# EAGLE board PC104 (EAGLE 7.4.0), part 1 of 2
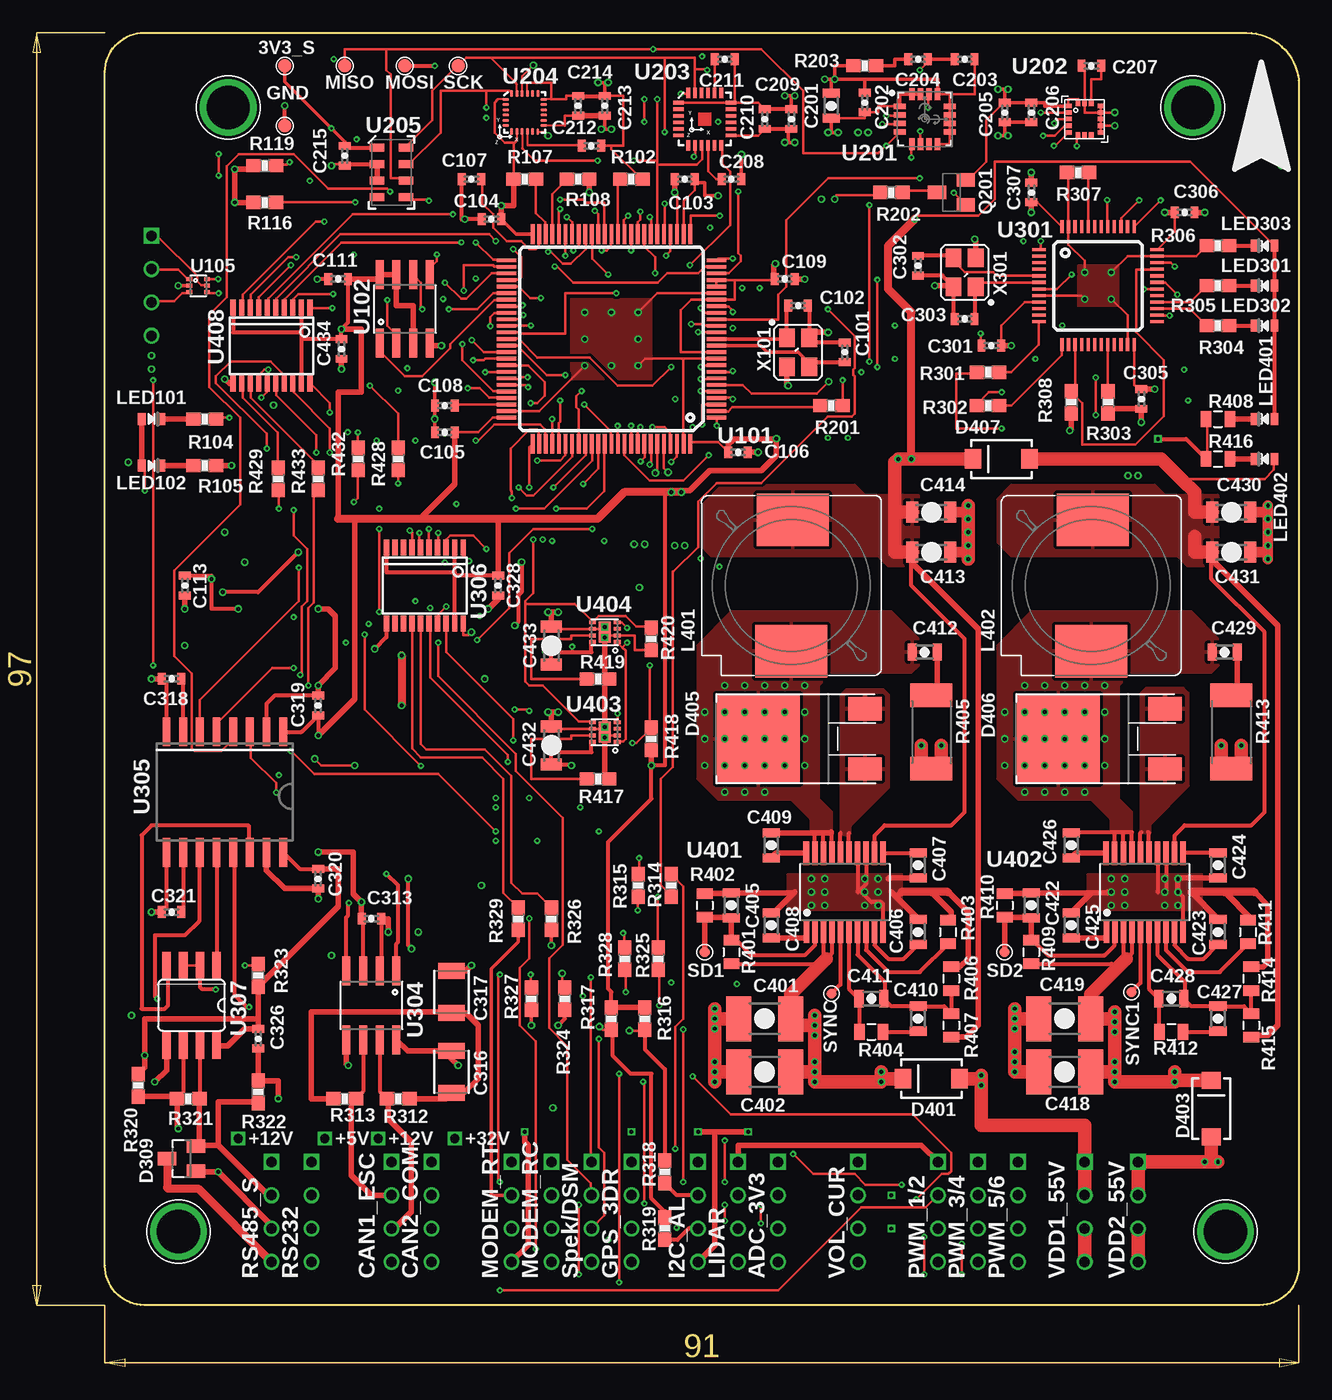
[diagram p5: board, top side]
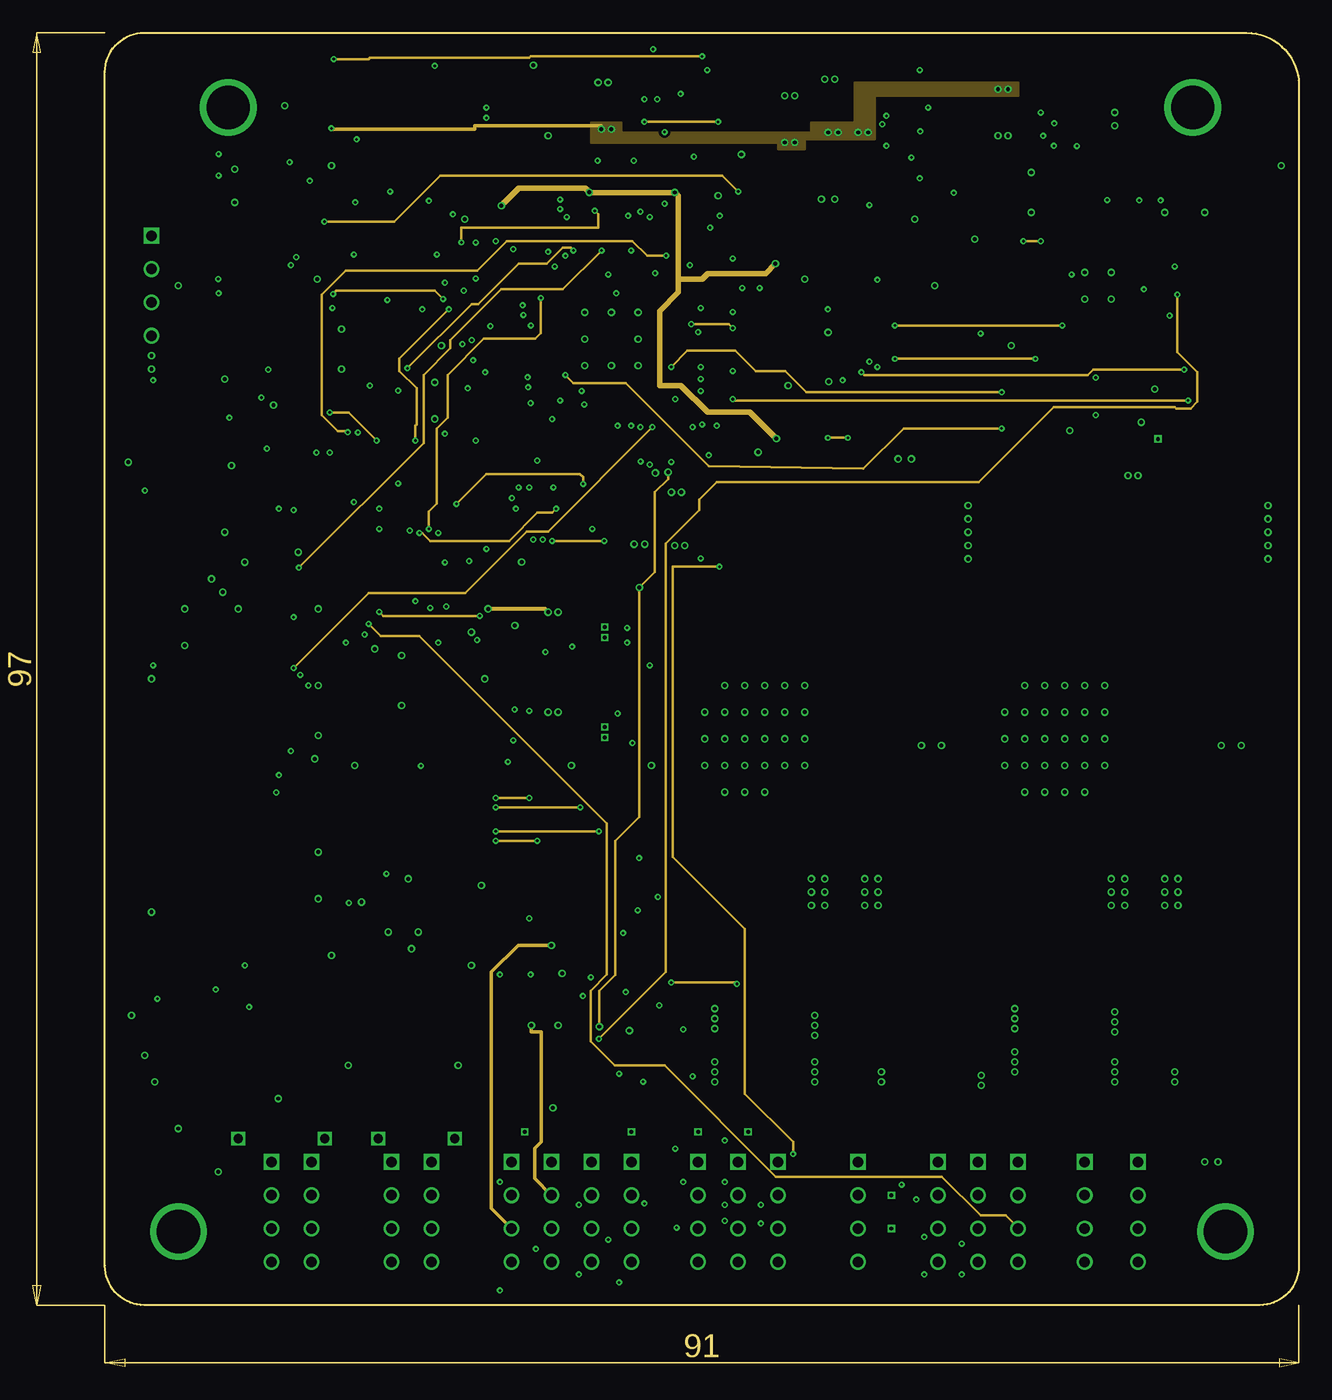
[diagram p6: board, inner layer Route2]
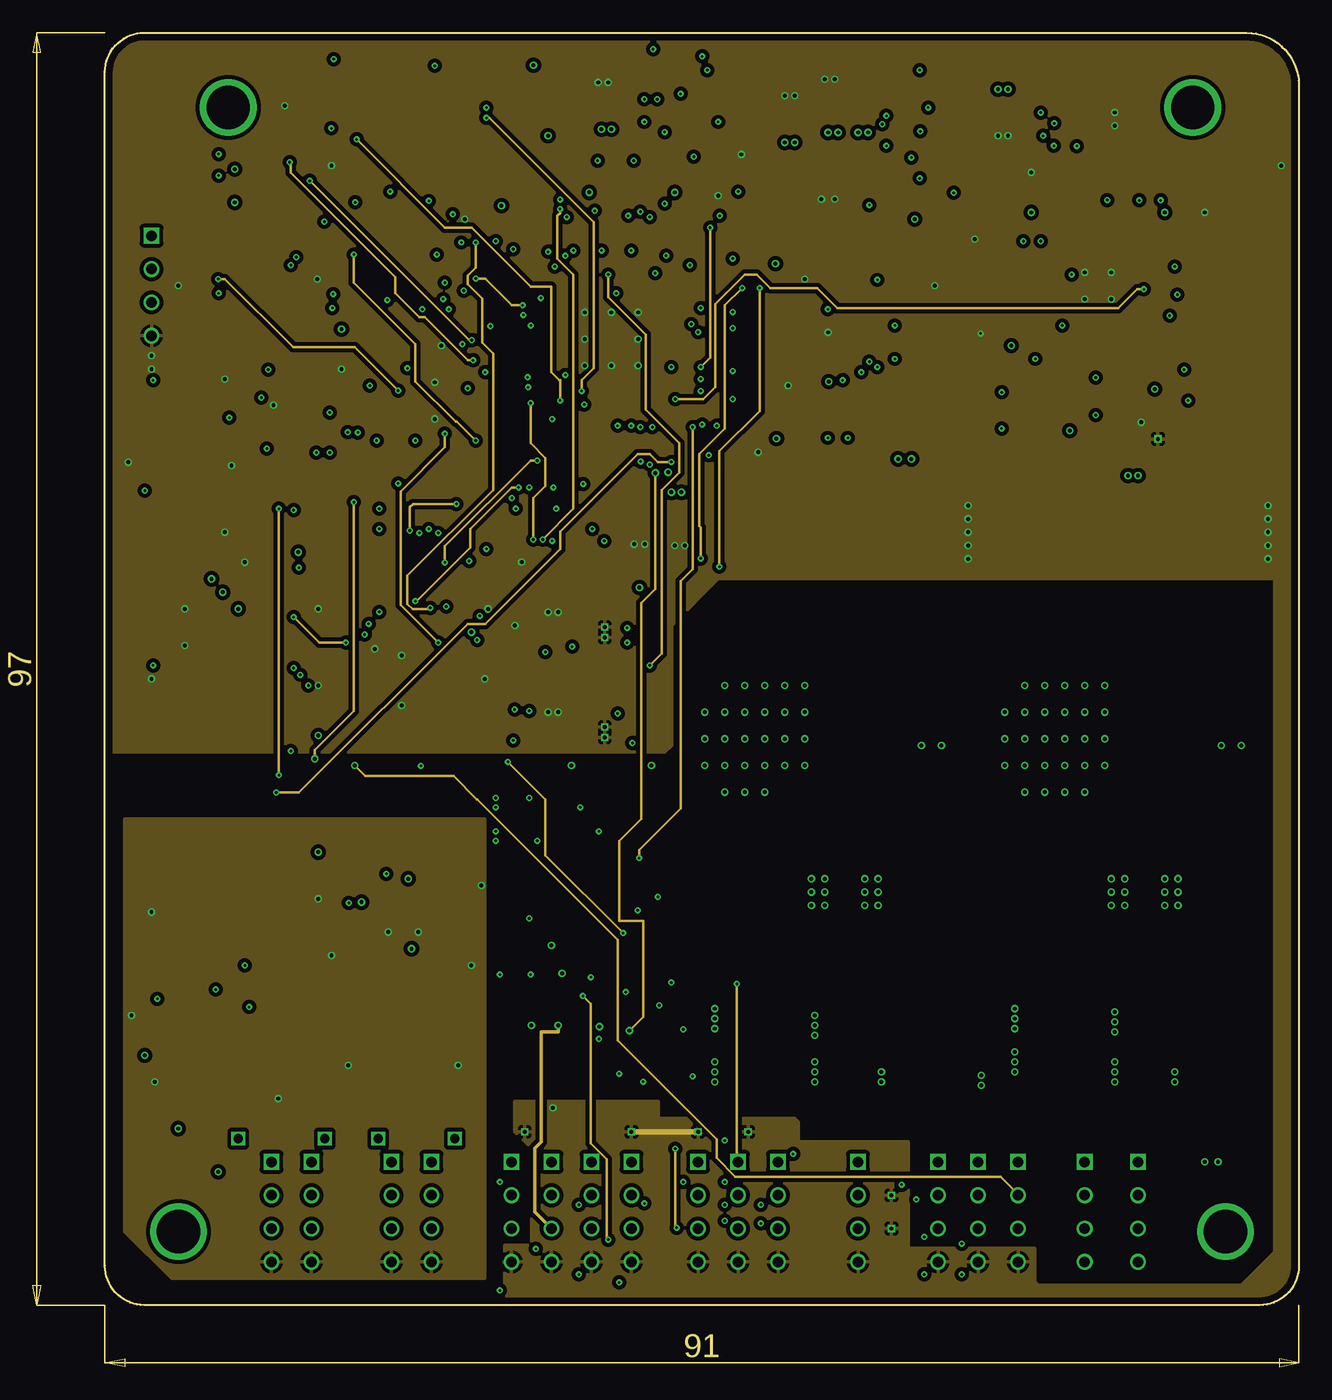
[diagram p7: board, inner layer Route15]
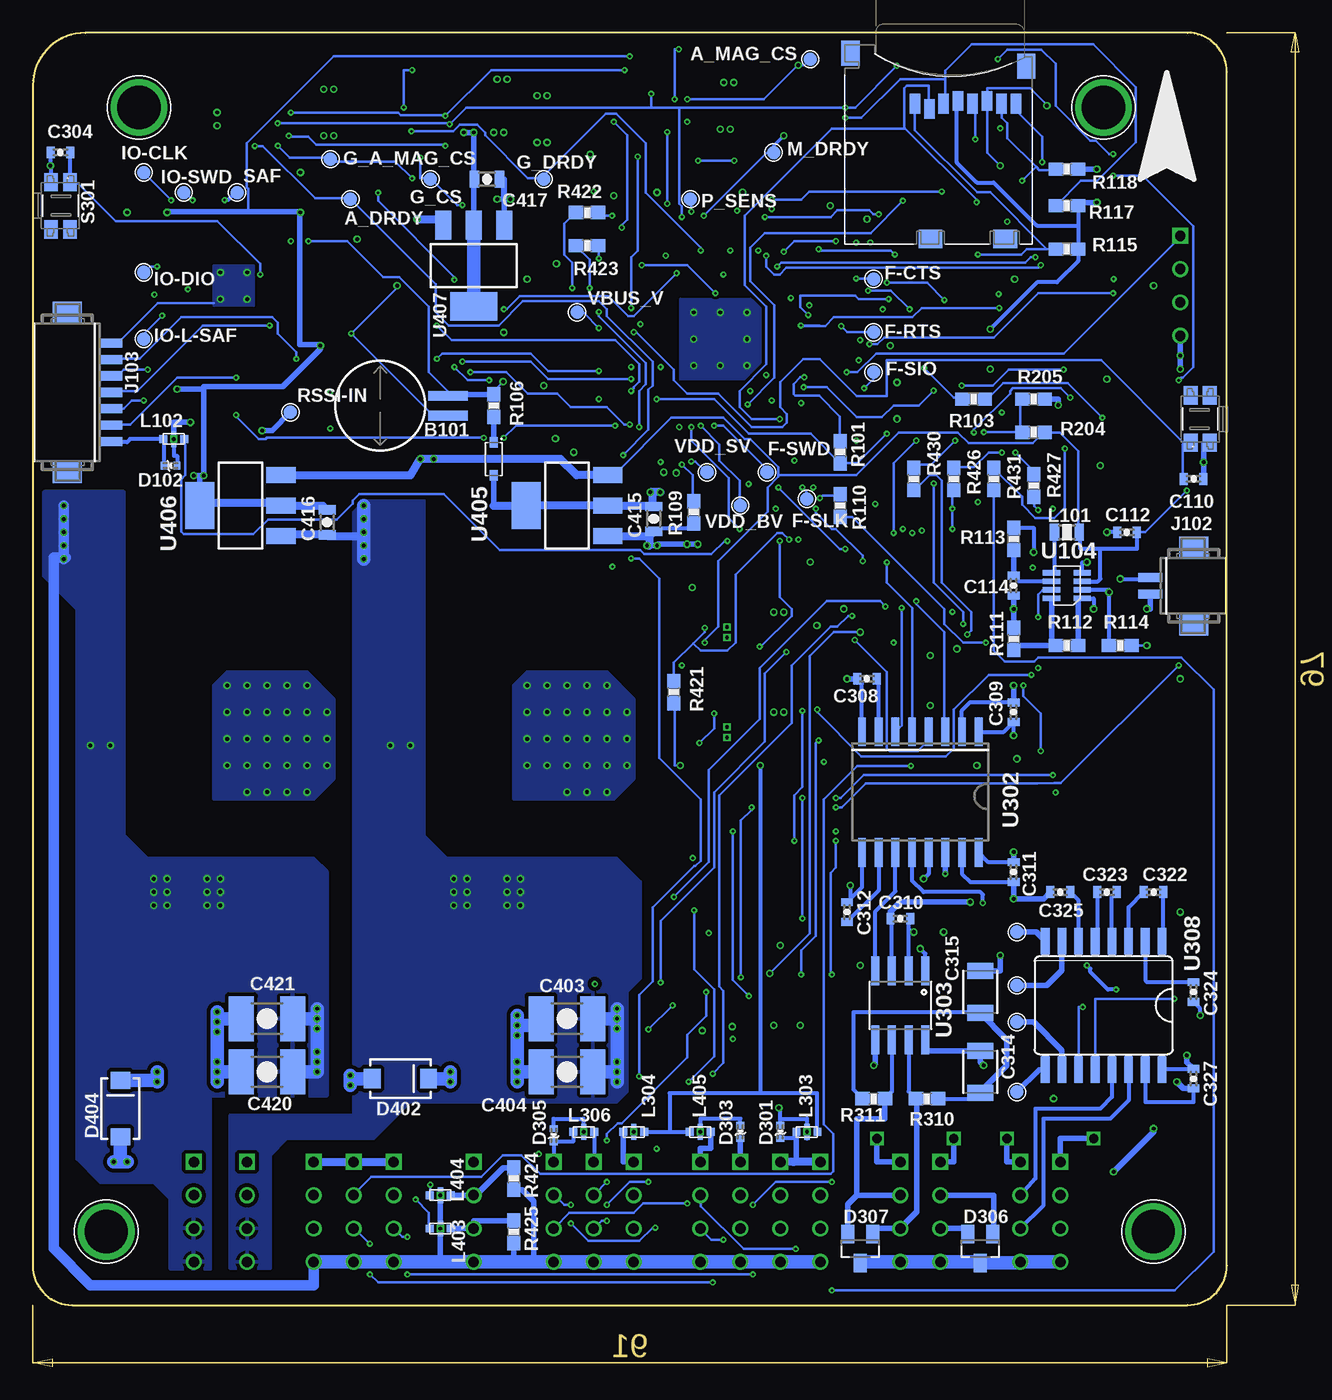
[diagram p8: board, bottom side, seen from below]

Size 91 x 97 mm. Coordinates in mm from the lower left corner, seen from the top.
Outline: 0,3 0,94 arc-90 3,97 87,97 arc-90 91,93 91,3 arc-90 88,0 3,0 arc-90 0,3
Copper layers (1*2*15*16): Top 0.035mm / dielectric 0.66mm / Route2 0.035mm / dielectric 0.55mm / Route15 0.035mm / dielectric 0.65mm / Bottom 0.035mm
Design rules "default *": minimum track width 6mil, minimum drill 8mil, track to track 6mil, track to pad 6mil, pad to pad 6mil, via to via 8mil, smd to smd 0mil, copper to edge 20mil, drill to drill 8mil, minimum pad ring 5mil, minimum via ring 5mil, stop-mask expansion 4mil, vias tented up to drill 0mil, thermal gap 10mil
Net classes: 0 GND: width 0.127 mm, drill 0.102 mm, clearance 0.205 mm; 1 GND1: width 0.127 mm, drill 0.102 mm, clearance 0.205 mm to class 0, clearance 0.127 mm

## Footprints (pad centres in the part's own frame; a part is rotated, then mirrored left to right if it is on the bottom)
PAD.04X.04 = smd 1.016 x 1.016: P$1 0,0
MS621FE = smd 3 x 0.75: 1 5.15,0.75; 2 5.15,-0.75
0603-CAP = smd 0.6 x 0.9: P$1 -0.75,0; P$2 0.75,0
0805-CAP = smd 0.7 x 1.3: P$1 -0.95,0; P$2 0.95,0
1210 = smd 1.2 x 2: 1 -1.6,0; 2 1.6,0
1812-CAP = smd 1.905 x 3.429: 1 -1.968,0; 2 1.968,0
1206-CAP = smd 0.9 x 1.6: P$1 -1.45,0; P$2 1.45,0
SOD323 = smd 0.8 x 0.6: A 1.25,0; C -1.25,0
0402-TVS = smd 0.5 x 0.6: A 0.5,0; C -0.5,0
SOT23@1 = smd 1 x 1.4: 1 -0.95,-1.1; 2 0.95,-1.1; 3 0,1.1
SMA-DIODE = smd 1.27 x 1.47: A -2.15,0; C 2.15,0
SOT23 = smd 1.778 x 2.54: 1 -2.299,-3.077; 2 2.299,-3.077 | smd 6.858 x 6.35: 3 0,5.077
HEADER_2.54MM-1X04 = drill 0.8 square: 1 -3.81,0 | drill 0.8: 2 -1.27,0; 3 1.27,0; 4 3.81,0
DF13A-2P-1.25H = smd 0.7 x 1.8: 1 -0.605,-3.3; 2 0.645,-3.3 | smd 1.6 x 2.2: S1 2.995,0; S2 -2.955,0
DF13A-7P-1.25H = smd 0.7 x 1.8: 1 -3.75,-3.3; 2 -2.5,-3.3; 3 -1.25,-3.3; 4 0,-3.3; 5 1.25,-3.3; 6 2.5,-3.3; 7 3.75,-3.3 | smd 1.6 x 2.2: S1 6.1,0; S2 -6.1,0
0805-IND = smd 0.7 x 1.3: P$1 -0.95,0; P$2 0.95,0
KYOCERA-KNH16-DA = smd 0.6 x 0.6: P$1 -0.8,0; P$2 0.8,0 | smd 0.4 x 0.4: P$3 0,-0.4; P$4 0,0.4 | drill 0.3 pad 0.4 square: P$5 0,0
SLF10145 = smd 4 x 5.5: P$1 -5.004,0; P$2 5.006,-0.1
0603-LED = smd 0.6 x 0.9: A 0.75,0; C -0.75,0
SOT23-BEC = smd 1 x 1.4: B -0.95,-1.1; C 0,1.1; E 0.95,-1.1
0603-RES = smd 1.1 x 1: 1 -0.85,0; 2 0.85,0
0805 = smd 0.8 x 1.2: 1 -0.9,0; 2 0.9,0
R2512 = smd 1.8 x 3.2: 1 -2.8,0; 2 2.8,0
EVQP7J01K = smd 1.4 x 1.05: A1 -1.8,0.725; A2 1.8,0.725; B3 -1.8,-0.725; B4 1.8,-0.725
PAD.03X.03 = smd 0.762 x 0.762: P$1 0,0
TQFP100 = smd 1.5 x 0.29: 1 -8,6; 2 -8,5.5; 3 -8,5; 4 -8,4.5; 5 -8,4; 6 -8,3.5; 7 -8,3; 8 -8,2.5; 9 -8,2; 10 -8,1.5; 11 -8,1; 12 -8,0.5; 13 -8,0; 14 -8,-0.5; 15 -8,-1; 16 -8,-1.5; 17 -8,-2; 18 -8,-2.5; 19 -8,-3; 20 -8,-3.5; 21 -8,-4; 22 -8,-4.5; 23 -8,-5; 24 -8,-5.5; 25 -8,-6; 51 8,-6; 52 8,-5.5; 53 8,-5; 54 8,-4.5; 55 8,-4; 56 8,-3.5; 57 8,-3; 58 8,-2.5; 59 8,-2; 60 8,-1.5; 61 8,-1; 62 8,-0.5; 63 8,0; 64 8,0.5; 65 8,1; 66 8,1.5; 67 8,2; 68 8,2.5; 69 8,3; 70 8,3.5; 71 8,4; 72 8,4.5; 73 8,5; 74 8,5.5; 75 8,6 | smd 0.29 x 1.5: 26 -6,-8; 27 -5.5,-8; 28 -5,-8; 29 -4.5,-8; 30 -4,-8; 31 -3.5,-8; 32 -3,-8; 33 -2.5,-8; 34 -2,-8; 35 -1.5,-8; 36 -1,-8; 37 -0.5,-8; 38 0,-8; 39 0.5,-8; 40 1,-8; 41 1.5,-8; 42 2,-8; 43 2.5,-8; 44 3,-8; 45 3.5,-8; 46 4,-8; 47 4.5,-8; 48 5,-8; 49 5.5,-8; 50 6,-8; 76 6,8; 77 5.5,8; 78 5,8; 79 4.5,8; 80 4,8; 81 3.5,8; 82 3,8; 83 2.5,8; 84 2,8; 85 1.5,8; 86 1,8; 87 0.5,8; 88 0,8; 89 -0.5,8; 90 -1,8; 91 -1.5,8; 92 -2,8; 93 -2.5,8; 94 -3,8; 95 -3.5,8; 96 -4,8; 97 -4.5,8; 98 -5,8; 99 -5.5,8; 100 -6,8
SO08 = smd 0.61 x 2.21: 1 -1.905,-2.616; 2 -0.635,-2.616; 3 0.635,-2.616; 4 1.905,-2.616; 5 1.905,2.616; 6 0.635,2.616; 7 -0.635,2.616; 8 -1.905,2.616
MICROSD = smd 0.8 x 1.5: 1 -1.94,2.7; 2 -0.84,2.3; 3 0.26,2.7; 4 1.36,2.9; 5 2.46,2.7; 6 3.56,2.9; 7 4.66,2.7; 8 5.76,2.7 | smd 1.4 x 1.9: NC -6.85,6.55; NC3 6.55,5.55 | smd 1.8 x 1.4: NC1 -0.75,-7.6; NC2 4.95,-7.6
SOT23-8 = smd 0.42 x 1.3: 1 -0.975,-1.175; 2 -0.325,-1.175; 3 0.325,-1.175; 4 0.975,-1.175; 5 0.975,1.175; 6 0.325,1.175; 7 -0.325,1.175; 8 -0.975,1.175
SOT563-6 = smd 0.3 x 0.45: 1 -0.5,-0.675; 2 0,-0.675; 3 0.5,-0.675; 4 0.5,0.675; 5 0,0.675; 6 -0.5,0.675
L3G4200DH-MAN = smd 0.9 x 0.4: 1 -1.9,0.975; 2 -1.9,0.325; 3 -1.9,-0.325; 4 -1.9,-0.975; 9 1.9,-0.975; 10 1.9,-0.325; 11 1.9,0.325; 12 1.9,0.975 | smd 0.4 x 0.9: 5 -0.975,-1.9; 6 -0.325,-1.9; 7 0.325,-1.9; 8 0.975,-1.9; 13 0.975,1.9; 14 0.325,1.9; 15 -0.325,1.9; 16 -0.975,1.9
LGA-16-3PX5P = smd 0.45 x 0.35: 1 -1.225,1; 2 -1.225,0.5; 3 -1.225,0; 4 -1.225,-0.5; 5 -1.225,-1; 9 1.225,-1; 10 1.225,-0.5; 11 1.225,0; 12 1.225,0.5; 13 1.225,1 | smd 0.35 x 0.45: 6 -0.5,-1.225; 7 0,-1.225; 8 0.5,-1.225; 14 0.5,1.225; 15 0,1.225; 16 -0.5,1.225
QFN-24 = smd 0.8 x 0.29: 1 -2,1.25; 2 -2,0.75; 3 -2,0.25; 4 -2,-0.25; 5 -2,-0.75; 6 -2,-1.25; 13 2,-1.25; 14 2,-0.75; 15 2,-0.25; 16 2,0.25; 17 2,0.75; 18 2,1.25 | smd 0.29 x 0.8: 7 -1.25,-2; 8 -0.75,-2; 9 -0.25,-2; 10 0.25,-2; 11 0.75,-2; 12 1.25,-2; 19 1.25,2; 20 0.75,2; 21 0.25,2; 22 -0.25,2; 23 -0.75,2; 24 -1.25,2
MPU-6500 = smd 0.508 x 0.203: 1 -1.45,1; 2 -1.45,0.6; 3 -1.45,0.2; 4 -1.45,-0.2; 5 -1.45,-0.6; 6 -1.45,-1; 13 1.45,-1; 14 1.45,-0.6; 15 1.45,-0.2; 16 1.45,0.2; 17 1.45,0.6; 18 1.45,1 | smd 0.203 x 0.508: 7 -1,-1.45; 8 -0.6,-1.45; 9 -0.2,-1.45; 10 0.2,-1.45; 11 0.6,-1.45; 12 0.99,-1.46; 19 1,1.45; 20 0.6,1.45; 21 0.2,1.45; 22 -0.2,1.45; 23 -0.6,1.45; 24 -1,1.45
MS5611-01BA = smd 1.1 x 0.6: 1 -1.1,1.875; 2 -1.1,0.625; 3 -1.1,-0.625; 4 -1.1,-1.875; 5 1.1,-1.875; 6 1.1,-0.625; 7 1.1,0.625; 8 1.1,1.875
TQFP48 = smd 0.24 x 1: 1 -2.75,-4.5; 2 -2.25,-4.5; 3 -1.75,-4.5; 4 -1.25,-4.5; 5 -0.75,-4.5; 6 -0.25,-4.5; 7 0.25,-4.5; 8 0.75,-4.5; 9 1.25,-4.5; 10 1.75,-4.5; 11 2.25,-4.5; 12 2.75,-4.5; 25 2.75,4.5; 26 2.25,4.5; 27 1.75,4.5; 28 1.25,4.5; 29 0.75,4.5; 30 0.25,4.5; 31 -0.25,4.5; 32 -0.75,4.5; 33 -1.25,4.5; 34 -1.75,4.5; 35 -2.25,4.5; 36 -2.75,4.5 | smd 1 x 0.24: 13 4.5,-2.75; 14 4.5,-2.25; 15 4.5,-1.75; 16 4.5,-1.25; 17 4.5,-0.75; 18 4.5,-0.25; 19 4.5,0.25; 20 4.5,0.75; 21 4.5,1.25; 22 4.5,1.75; 23 4.5,2.25; 24 4.5,2.75; 37 -4.5,2.75; 38 -4.5,2.25; 39 -4.5,1.75; 40 -4.5,1.25; 41 -4.5,0.75; 42 -4.5,0.25; 43 -4.5,-0.25; 44 -4.5,-0.75; 45 -4.5,-1.25; 46 -4.5,-1.75; 47 -4.5,-2.25; 48 -4.5,-2.75
SO-16W = smd 0.6 x 2.2: 1 -4.445,-4.6; 2 -3.175,-4.6; 3 -1.905,-4.6; 4 -0.635,-4.6; 5 0.635,-4.6; 6 1.905,-4.6; 7 3.175,-4.6; 8 4.445,-4.6; 9 4.445,4.6; 10 3.175,4.6; 11 1.905,4.6; 12 0.635,4.6; 13 -0.635,4.6; 14 -1.905,4.6; 15 -3.175,4.6; 16 -4.445,4.6
R-PDSO-G20 = smd 0.4 x 1.2: 1 -2.925,-2.9; 2 -2.275,-2.9; 3 -1.625,-2.9; 4 -0.975,-2.9; 5 -0.325,-2.9; 6 0.325,-2.9; 7 0.975,-2.9; 8 1.625,-2.9; 9 2.275,-2.9; 10 2.925,-2.9; 11 2.925,2.9; 12 2.275,2.9; 13 1.625,2.9; 14 0.975,2.9; 15 0.325,2.9; 16 -0.325,2.9; 17 -0.975,2.9; 18 -1.625,2.9; 19 -2.275,2.9; 20 -2.925,2.9
SO08' = smd 0.66 x 2.032: 1 -1.905,-3.073; 2 -0.635,-3.073; 3 0.635,-3.073; 4 1.905,-3.073; 5 1.905,3.073; 6 0.635,3.073; 7 -0.635,3.073; 8 -1.905,3.073
SO16L = smd 0.66 x 2.032: 1 -4.445,-4.902; 2 -3.175,-4.902; 3 -1.905,-4.902; 4 -0.635,-4.902; 5 0.635,-4.902; 6 1.905,-4.902; 7 3.175,-4.902; 8 4.445,-4.902; 9 4.445,4.902; 10 3.175,4.902; 11 1.905,4.902; 12 0.635,4.902; 13 -0.635,4.902; 14 -1.905,4.902; 15 -3.175,4.902; 16 -4.445,4.902
TSSOP20 = smd 0.42 x 1.78: 1 -2.926,-2.975; 2 -2.276,-2.975; 3 -1.626,-2.975; 4 -0.976,-2.975; 5 -0.326,-2.975; 6 0.324,-2.975; 7 0.974,-2.975; 8 1.625,-2.98; 9 2.277,-2.98; 10 2.929,-2.98; 11 2.93,2.975; 12 2.28,2.975; 13 1.63,2.975; 14 0.98,2.975; 15 0.323,2.979; 16 -0.322,2.979; 17 -0.979,2.979; 18 -1.624,2.975; 19 -2.281,2.975; 20 -2.932,2.975
QFN8-DSG = smd 0.28 x 0.5: 1 -0.75,-0.95; 2 -0.25,-0.95; 3 0.25,-0.95; 4 0.75,-0.95; 5 0.75,0.95; 6 0.25,0.95; 7 -0.25,0.95; 8 -0.75,0.95 | smd 1.6 x 0.9: GND 0,0 | drill 0.3 square: P$2 -0.4,0; P$3 0.4,0
SOT-223 = smd 1.219 x 2.235: 1 -2.311,-3.099; 2 0,-3.099; 3 2.311,-3.099 | smd 3.6 x 2.2: 4 0,3.099
MOUNT-HOLE3.3 = drill 3.3 pad 4.3: P$1 0,0
OSCILLATOR-3.2X2.5 = smd 1.4 x 1.2: 1 -1.1,-0.85; 2 1.1,-0.85; 3 1.1,0.85; 4 -1.1,0.85

## Placement (x,y rotation side)
3V3_S  PAD.04  [PAD.04X.04]  13.71,94.48 0 top
A_DRDY  PAD.04  [PAD.04X.04]  66.79,84.32 0 bottom
A_MAG_CS  PAD.04  [PAD.04X.04]  31.74,94.99 0 bottom
B101  MS621FE  [MS621FE]  64.51,68.57 0 bottom
C101  8p  [0603-CAP]  56.38,72.64 90 top
C102  8p  [0603-CAP]  52.82,76.19 180 top
C103  0u1  [0603-CAP]  44.19,85.84 0 top
C104  0u1  [0603-CAP]  29.46,82.8 180 top
C105  0u1  [0603-CAP]  25.9,66.54 180 top
C106  0u1  [0603-CAP]  48.25,65.02 0 top
C107  2u2  [0603-CAP]  27.93,85.84 180 top
C108  2u2  [0603-CAP]  25.9,68.57 180 top
C109  0u1  [0603-CAP]  51.81,78.22 0 top
C110  0u1  [0603-CAP]  2.53,62.98 0 bottom
C111  0u1  [0603-CAP]  17.77,78.22 180 top
C112  1u  [0603-CAP]  7.61,58.92 180 bottom
C113  5n6  [0603-CAP]  6.09,54.86 270 top
C114  0u47  [0603-CAP]  16.25,54.86 270 bottom
C201  10u  [0805-CAP]  55.36,91.43 90 top
C202  0u1  [0603-CAP]  57.9,91.69 90 top
C203  0u1  [0603-CAP]  65.52,94.99 0 top
C204  0u47  [0603-CAP]  61.97,94.99 180 top
C205  2u2  [0603-CAP]  68.57,90.92 270 top
C206  0u1  [0603-CAP]  70.6,90.92 270 top
C207  0u47  [0603-CAP]  75.18,94.48 180 top
C208  2u2  [0603-CAP]  47.74,85.84 0 top
C209  2u2  [0603-CAP]  52.32,90.42 90 top
C210  0u1  [0603-CAP]  50.28,90.42 90 top
C211  0u01  [0603-CAP]  47.24,94.99 0 top
C212  0u1  [0603-CAP]  37.08,88.38 0 top
C213  2u2  [0603-CAP]  38.09,91.43 90 top
C214  0u1  [0603-CAP]  36.06,91.43 90 top
C215  0u1  [0603-CAP]  18.28,87.62 270 top
C301  0u1  [0603-CAP]  67.56,73.14 180 top
C302  8p  [0603-CAP]  61.97,79.24 270 top
C303  8p  [0603-CAP]  65.52,75.18 0 top
C304  0u1  [0603-CAP]  88.89,87.88 180 bottom
C305  0u1  [0603-CAP]  78.99,69.08 270 top
C306  0u1  [0603-CAP]  82.29,83.3 0 top
C307  0u1  [0603-CAP]  70.6,84.83 90 top
C308  0u1  [0603-CAP]  27.42,47.74 180 bottom
C309  0u1  [0603-CAP]  16.25,45.2 90 bottom
C310  0u1  [0603-CAP]  24.88,29.46 0 bottom
C311  0u1  [0603-CAP]  16.25,33.01 270 bottom
C312  0u1  [0603-CAP]  28.95,29.96 90 bottom
C313  0u1  [0603-CAP]  20.31,29.46 0 top
C314  0u330  [1210]  18.79,17.77 90 bottom
C315  0u330  [1210]  18.79,23.87 90 bottom
C316  0u330  [1210]  26.41,17.77 90 top
C317  0u330  [1210]  26.41,23.87 90 top
C318  0u1  [0603-CAP]  5.07,47.74 180 top
C319  0u1  [0603-CAP]  16.25,45.71 90 top
C320  0u1  [0603-CAP]  16.25,32.5 270 top
C321  0u1  [0603-CAP]  5.07,29.96 180 top
C322  1u  [0603-CAP]  5.58,31.49 0 bottom
C323  1u  [0603-CAP]  9.14,31.49 0 bottom
C324  1u  [0603-CAP]  2.53,23.87 270 bottom
C325  1u  [0603-CAP]  12.69,31.49 180 bottom
C326  0u1  [0603-CAP]  11.68,20.31 270 top
C327  0u1  [0603-CAP]  2.53,17.26 270 bottom
C328  0u1  [0603-CAP]  29.96,54.86 270 top
C401  2u2  [1812-CAP]  50.28,21.84 180 top
C402  2u2  [1812-CAP]  50.28,17.77 180 top
C403  2u2  [1812-CAP]  50.28,21.84 0 bottom
C404  2u2  [1812-CAP]  50.28,17.77 0 bottom
C405  0u01  [0805-CAP]  47.74,30.47 90 top
C406  330p  [0805-CAP]  61.97,28.44 90 top
C407  0u01  [0805-CAP]  61.97,33.52 270 top
C408  0u47  [0805-CAP]  50.79,28.95 90 top
C409  0.022  [0805-CAP]  50.79,35.04 270 top
C410  0u01  [0805-CAP]  61.97,21.84 270 top
C411  [0805-CAP]  58.41,23.36 180 top
C412  330p  [0805-CAP]  62.48,49.78 0 top
C413  150u  [1206-CAP]  62.98,57.4 0 top
C414  22u  [1206-CAP]  62.98,60.44 0 top
C415  0u1  [0805-CAP]  43.68,59.94 270 bottom
C416  0u1  [0805-CAP]  68.57,59.68 270 bottom
C417  0u1  [0805-CAP]  56.38,85.84 0 bottom
C418  2u2  [1812-CAP]  73.14,17.77 180 top
C419  2u2  [1812-CAP]  73.14,21.84 180 top
C420  2u2  [1812-CAP]  73.14,17.77 0 bottom
C421  2u2  [1812-CAP]  73.14,21.84 0 bottom
C422  0u01  [0805-CAP]  70.6,30.47 90 top
C423  330p  [0805-CAP]  84.83,28.44 90 top
C424  0u01  [0805-CAP]  84.83,33.52 270 top
C425  0u47  [0805-CAP]  73.65,28.95 90 top
C426  0.022  [0805-CAP]  73.65,35.04 270 top
C427  0u01  [0805-CAP]  84.83,21.84 270 top
C428  [0805-CAP]  81.27,23.36 180 top
C429  330p  [0805-CAP]  85.34,49.78 0 top
C430  150u  [1206-CAP]  85.84,60.44 0 top
C431  22u  [1206-CAP]  85.84,57.4 0 top
C432  100u  [1206-CAP]  34.03,42.66 90 top
C433  100u  [1206-CAP]  34.03,50.28 90 top
C434  0u1  [0603-CAP]  18.03,72.89 270 top
D101  RB751V40T1G  [SOD323]  55.87,64.51 270 bottom
D102  PESD0402-140  [0402-TVS]  80.51,64 0 bottom
D301  PESD0402-140  [0402-TVS]  34.03,13.2 90 bottom
D303  PESD0402-140  [0402-TVS]  37.08,13.2 90 bottom
D305  PESD0402-140  [0402-TVS]  51.3,12.95 90 bottom
D306  PESD1CAN  [SOT23@1]  18.79,4.31 180 bottom
D307  PESD1CAN  [SOT23@1]  27.93,4.31 180 bottom
D309  PESD1CAN  [SOT23@1]  5.83,11.17 90 top
D401  30BQ100  [SMA-DIODE]  62.98,17.26 180 top
D402  30BQ100  [SMA-DIODE]  62.98,17.26 0 bottom
D403  30BQ100  [SMA-DIODE]  84.32,14.98 90 top
D404  30BQ100  [SMA-DIODE]  84.32,14.98 90 bottom
D405  6CWQ10F  [SOT23]  54.86,43.17 90 top
D406  6CWQ10F  [SOT23]  77.72,43.17 90 top
D407  30BQ060  [SMA-DIODE]  68.32,64.51 180 top
F-CTS  PAD.04  [PAD.04X.04]  26.92,78.22 0 bottom
F-RTS  PAD.04  [PAD.04X.04]  26.92,74.16 0 bottom
F-SIO  PAD.04  [PAD.04X.04]  26.92,71.11 0 bottom
F-SLK  PAD.04  [PAD.04X.04]  32,61.46 0 bottom
F-SWD  PAD.04  [PAD.04X.04]  35.04,63.49 0 bottom
G_A_MAG_CS  PAD.04  [PAD.04X.04]  68.32,87.37 0 bottom
G_CS  PAD.04  [PAD.04X.04]  60.7,85.84 0 bottom
G_DRDY  PAD.04  [PAD.04X.04]  52.06,85.84 0 bottom
GND  PAD.04  [PAD.04X.04]  13.71,89.91 0 top
IO-CLK  PAD.04  [PAD.04X.04]  82.54,86.35 0 bottom
IO-DIO  TP31  [PAD.04X.04]  82.54,78.73 0 bottom
IO-L-SAF  PAD.04  [PAD.04X.04]  82.54,73.65 0 bottom
IO-SWD  PAD.04  [PAD.04X.04]  79.49,84.83 0 bottom
J101  HEADER_1X4  [HEADER_2.54MM-1X04]  3.55,77.72 270 top
J102  DF13-2P-1.25H  [DF13A-2P-1.25H]  2.53,54.86 270 bottom
J103  DF13-7P-1.25H  [DF13A-7P-1.25H]  88.38,69.59 90 bottom
J301  HEADER_1X4  [HEADER_2.54MM-1X04]  21.84,7.1 270 top
J302  HEADER_1X4  [HEADER_2.54MM-1X04]  24.88,7.1 270 top
J304  HEADER_1X4  [HEADER_2.54MM-1X04]  12.69,7.1 270 top
J305  HEADER_1X4  [HEADER_2.54MM-1X04]  15.74,7.1 270 top
J306  HEADER_1X4  [HEADER_2.54MM-1X04]  30.98,7.1 270 top
J307  HEADER_1X4  [HEADER_2.54MM-1X04]  34.03,7.1 270 top
J308  HEADER_1X4  [HEADER_2.54MM-1X04]  45.2,7.1 270 top
J309  HEADER_1X4  [HEADER_2.54MM-1X04]  37.08,7.1 270 top
J310  HEADER_1X4  [HEADER_2.54MM-1X04]  48.25,7.1 270 top
J311  HEADER_1X4  [HEADER_2.54MM-1X04]  51.3,7.1 270 top
J401  HEADER_1X4  [HEADER_2.54MM-1X04]  74.67,7.1 270 top
J402  HEADER_1X4  [HEADER_2.54MM-1X04]  78.73,7.1 270 top
J403  HEADER_1X4  [HEADER_2.54MM-1X04]  66.54,7.1 270 top
J404  HEADER_1X4  [HEADER_2.54MM-1X04]  63.49,7.1 270 top
J405  HEADER_1X4  [HEADER_2.54MM-1X04]  69.59,7.1 270 top
J406  HEADER_1X4  [HEADER_2.54MM-1X04]  40.12,7.1 270 top
J407  HEADER_1X4  [HEADER_2.54MM-1X04]  57.4,7.1 270 top
L101  47uH  [0805-IND]  12.18,58.92 180 bottom
L102  KNH16C104DA5TS  [KYOCERA-KNH16-DA]  80.26,66.03 180 bottom
L303  KNH16C104DA5TS  [KYOCERA-KNH16-DA]  32,13.2 180 bottom
L304  KNH16C104DA5TS  [KYOCERA-KNH16-DA]  45.2,13.2 180 bottom
L306  KNH16C104DA5TS  [KYOCERA-KNH16-DA]  49.01,13.2 180 bottom
L401  DR127-330/33uH  [SLF10145]  52.32,54.86 90 top
L402  DR127-330/33uH  [SLF10145]  75.18,54.86 90 top
L403  KNH16C104DA5TS  [KYOCERA-KNH16-DA]  59.94,5.83 180 bottom
L404  KNH16C104DA5TS  [KYOCERA-KNH16-DA]  59.94,8.37 180 bottom
L405  KNH16C104DA5TS  [KYOCERA-KNH16-DA]  40.12,13.2 0 bottom
LED101  AMBER  [0603-LED]  3.55,67.56 180 top
LED102  GREEN  [0603-LED]  3.55,64 180 top
LED301  AMBER  [0603-LED]  88.38,77.72 0 top
LED302  BLUE  [0603-LED]  88.38,74.67 0 top
LED303  GREEN  [0603-LED]  88.38,80.76 0 top
LED401  [0603-LED]  88.38,67.56 0 top
LED402  [0603-LED]  88.38,64.51 0 top
M_DRDY  PAD.04  [PAD.04X.04]  34.54,87.88 0 bottom
MISO  PAD.04  [PAD.04X.04]  18.28,94.48 0 top
MOSI  PAD.04  [PAD.04X.04]  22.85,94.48 0 top
P_SENS  PAD.04  [PAD.04X.04]  40.89,84.32 0 bottom
Q201  MMBT3906LT1SMD  [SOT23-BEC]  64.51,84.83 90 top
R2IN_2  PAD.04  [PAD.04X.04]  15.99,28.44 0 bottom
R2O_1  PAD.04  [PAD.04X.04]  15.99,16.25 0 bottom
R101  470R  [0603-RES]  29.46,65.02 270 bottom
R102  10K  [0603-RES]  40.12,85.84 0 top
R103  220R  [0603-RES]  19.3,69.08 0 bottom
R104  220R  [0603-RES]  7.61,67.56 180 top
R105  220R  [0603-RES]  7.61,64 180 top
R106  1K  [0603-RES]  55.87,68.57 270 bottom
R107  1K5  [0603-RES]  32,85.84 180 top
R108  1K5  [0603-RES]  36.06,85.84 0 top
R109  10K  [0603-RES]  40.63,60.44 90 bottom
R110  9K09  [0603-RES]  29.46,60.95 270 bottom
R111  10K  [0603-RES]  16.25,50.79 270 bottom
R112  100K  [0603-RES]  12.18,50.28 0 bottom
R113  453K  [0603-RES]  16.25,58.41 90 bottom
R114  16K5  [0603-RES]  8.12,50.28 0 bottom
R115  220R  [0603-RES]  12.18,80.51 0 bottom
R116  220R  [0603-RES]  12.18,84.07 180 top
R117  220R  [0603-RES]  12.18,83.81 0 bottom
R118  220R  [0603-RES]  12.18,86.61 0 bottom
R119  220R  [0603-RES]  12.18,86.86 180 top
R201  1K8  [0603-RES]  55.36,68.57 0 top
R202  10R  [0603-RES]  59.94,84.83 0 top
R203  10K  [0603-RES]  57.9,94.48 0 top
R204  10K/0.1%  [0603-RES]  14.72,66.54 180 bottom
R205  10K/0.1%  [0603-RES]  14.72,69.08 180 bottom
R301  220R  [0603-RES]  67.3,71.11 180 top
R302  220R  [0603-RES]  67.3,68.57 180 top
R303  10K  [0603-RES]  76.45,68.83 270 top
R304  220R  [0603-RES]  84.83,74.67 0 top
R305  442R  [0603-RES]  84.83,77.72 0 top
R306  220R  [0603-RES]  84.83,80.76 0 top
R307  10K  [0603-RES]  74.16,86.35 0 top
R308  10K  [0603-RES]  73.65,68.83 270 top
R310  60R  [0603-RES]  22.85,15.74 180 bottom
R311  60R  [0603-RES]  26.92,15.74 180 bottom
R312  60R  [0603-RES]  22.34,15.74 180 top
R313  60R  [0603-RES]  18.28,15.74 180 top
R314  10K/0.1%  [0603-RES]  43.17,32 90 top
R315  10K/0.1%  [0603-RES]  40.63,32 270 top
R316  1K5  [0603-RES]  41.14,21.84 90 top
R317  1K5  [0603-RES]  38.6,21.84 90 top
R318  120R  [0603-RES]  42.66,10.15 270 top
R319  120R  [0603-RES]  42.66,5.83 270 top
R320  1K2  [0603-RES]  2.53,16.76 270 top
R321  120R  [0603-RES]  6.34,15.74 180 top
R322  1K2  [0603-RES]  11.68,16.25 90 top
R323  1K  [0603-RES]  11.68,25.14 90 top
R324  120R  [0603-RES]  35.04,23.36 270 top
R325  120R  [0603-RES]  42.16,26.41 270 top
R326  120R  [0603-RES]  34.03,29.46 270 top
R327  120R  [0603-RES]  32.5,23.36 270 top
R328  120R  [0603-RES]  39.62,26.41 270 top
R329  120R  [0603-RES]  31.49,29.46 270 top
R401  [0805]  47.74,26.92 270 top
R402  [0805]  45.71,30.47 270 top
R403  21K  [0805]  64.25,28.44 270 top
R404  49K9  [0805]  58.41,20.82 0 top
R405  10R  [R2512]  62.98,43.68 270 top
R406  1K65  [0805]  64.51,24.88 270 top
R407  5K11  [0805]  64.51,21.33 270 top
R408  330R  [0805]  84.83,67.56 0 top
R409  100K  [0805]  70.6,26.92 270 top
R410  100K  [0805]  68.57,30.47 270 top
R411  21K  [0805]  87.11,28.44 270 top
R412  49K9  [0805]  81.27,20.82 0 top
R413  10R  [R2512]  85.84,43.68 270 top
R414  1K65  [0805]  87.37,24.88 270 top
R415  5K11  [0805]  87.37,21.33 270 top
R416  330R  [0805]  84.83,64.51 0 top
R417  16K5  [0603-RES]  37.58,40.12 180 top
R418  1M  [0603-RES]  41.65,43.17 270 top
R419  25K5  [0603-RES]  37.58,47.74 180 top
R420  10K  [0603-RES]  41.65,50.79 90 top
R421  1M  [0603-RES]  42.16,46.73 270 bottom
R422  120K  [0603-RES]  48.76,83.3 0 bottom
R423  120K  [0603-RES]  48.76,80.76 0 bottom
R424  1M  [0603-RES]  54.35,9.64 90 bottom
R425  1M  [0603-RES]  54.35,5.58 90 bottom
R426  220R  [0603-RES]  20.82,62.98 270 bottom
R427  220R  [0603-RES]  14.72,62.48 270 bottom
R428  220R  [0603-RES]  22.34,64.51 270 top
R429  120R  [0603-RES]  13.2,62.98 270 top
R430  220R  [0603-RES]  23.87,62.98 270 bottom
R431  220R  [0603-RES]  17.77,62.98 270 bottom
R432  220R  [0603-RES]  19.3,64.51 270 top
R433  120R  [0603-RES]  16.25,62.98 270 top
RSSI-IN  PAD.04  [PAD.04X.04]  71.37,68.06 0 bottom
S101  RESET  [EVQP7J01K]  2.02,67.56 90 bottom
S301  RESET  [EVQP7J01K]  88.89,83.81 270 bottom
SAF  PAD.04  [PAD.04X.04]  75.43,84.83 0 bottom
SCK  PAD.04  [PAD.04X.04]  26.92,94.48 0 top
SD1  CYNC  [PAD.03X.03]  45.71,26.92 0 top
SD2  CYNC  [PAD.03X.03]  68.57,26.92 0 top
SYNC  CYNC  [PAD.03X.03]  55.36,23.74 0 top
SYNC1  CYNC  [PAD.03X.03]  78.22,23.87 0 top
T2IN_1  T2IN  [PAD.04X.04]  15.99,21.58 0 bottom
T2O_2  PAD.04  [PAD.04X.04]  15.99,24.38 0 bottom
U101  STM32F427VIT  [TQFP100]  38.6,73.65 180 top
U102  FM25V01  [SO08]  22.85,75.94 0 top
U103  2908-05WB-MG  [MICROSD]  21.84,88.89 0 bottom
U104  LT3469  [SOT23-8]  12.18,54.86 90 bottom
U105  NUF2042XV6  [SOT563-6]  7.1,77.72 270 top
U201  L3G4200DH-MAN  [L3G4200DH-MAN]  62.48,90.42 0 top
U202  ICM20609  [LGA-16-3PX5P]  74.67,90.42 0 top
U203  MPU-6000  [QFN-24]  45.71,90.42 0 top
U204  MPU-9250  [MPU-6500]  32,90.92 0 top
U205  MS5611-01BA  [MS5611-01BA]  21.84,86.35 0 top
U301  STM32F103C8T  [TQFP48]  75.68,77.72 270 top
U302  ADUM5402  [SO-16W]  23.36,39.11 180 bottom
U303  MAX3051  [SO08]  24.88,22.85 180 bottom
U304  MAX3051  [SO08]  20.31,22.85 180 top
U305  ADUM5402  [SO-16W]  9.14,39.11 180 top
U306  TXS0108EPWR  [R-PDSO-G20]  24.38,54.86 180 top
U307  MAX13487E  [SO08']  6.6,22.85 180 top
U308  MAX232ECWE  [SO16L]  9.39,22.85 180 bottom
U401  LM5005  [TSSOP20]  56.38,31.49 0 top
U402  LM5005  [TSSOP20]  79.24,31.49 0 top
U403  BQ24315  [QFN8-DSG]  38.09,43.68 90 top
U404  BQ24315  [QFN8-DSG]  38.09,51.3 90 top
U405  LD1117AS33  [SOT-223]  50.28,60.95 90 bottom
U406  LD1117AS33  [SOT-223]  75.18,60.95 90 bottom
U407  LD1117AS33  [SOT-223]  57.4,79.24 180 bottom
U408  TXS0108EPWR  [R-PDSO-G20]  12.69,73.14 180 top
U$1  MOUNT-HOLE  [MOUNT-HOLE3.3]  9.4,91.3 0 top
U$2  MOUNT-HOLE  [MOUNT-HOLE3.3]  82.9,91.3 0 top
U$3  MOUNT-HOLE  [MOUNT-HOLE3.3]  85.4,5.6 0 top
U$4  MOUNT-HOLE  [MOUNT-HOLE3.3]  5.6,5.6 0 top
VBUS_V  PAD.04  [PAD.04X.04]  49.52,75.68 0 bottom
VDD_BV  PAD.04  [PAD.04X.04]  37.08,60.95 0 bottom
VDD_SV  PAD.04  [PAD.04X.04]  39.62,63.49 0 bottom
X101  ASTX-H11-24.000MHZ-T  [OSCILLATOR-3.2X2.5]  52.82,72.64 270 top
X301  ASTX-H11-24.000MHZ-T  [OSCILLATOR-3.2X2.5]  65.52,78.73 90 top

## Tracks (layer width: path | path; a pad name or v marks a point on that pad's centre or on a via)
!ACCEL_MAG_CS  (via drill 0.2, 0.3)
  Top 0.152: U204.22 31.8,93.67
  Top 0.203: 31.8,93.67 v32.66,94.53 | v45.4,71.53 45.4,71.63 46.52,71.63 U101.9 | v41.12,91.94 v41.12,90.2
  Route2 0.203: v41.12,90.2 v46.73,90.2
  Route15 0.203: v45.4,71.53 46.12,72.24 v46.12,82.14
  Bottom 0.203: A_MAG_CS.P$1 32.2,94.53 v32.66,94.53 32.75,94.49 35.3,91.94 v41.12,91.94 | v46.12,82.14 46.12,82.34 45.71,82.75 45.71,89.18 v46.73,90.2
!BARO_CS  (via drill 0.2)
  Top 0.203: 23.04,84.32 U205.5 23.05,84.28 24.58,84.28 v24.69,84.18 | v36.52,68.67 38.56,66.63 38.56,65.71 U101.88
  Bottom 0.203: v24.69,84.18 27.14,81.73 35.2,81.73 36.32,80.61 36.32,78.06 34.48,76.22 34.48,70.71 v36.52,68.67
!FRAM_CS
  Top 0.203: U101.57 30.5,76.63 29.69,76.63 26.32,73.26 26.32,72.96 24.18,70.81 22.85,70.81 21.01,72.65 21.01,73.26 U102.1
!GPIO_ACCEL_MAG_CS  (via drill 0.2)
  Top 0.203: 73.53,89.4 U202.5 72.41,88.38 v72.32,88.38 | v62.09,85.91 55.11,85.91 51.94,82.73 51.94,77.65 51.3,77.02 51.3,75.11 46.85,75.11 U101.16
  Bottom 0.203: v62.09,85.91 63.37,87.18 68.13,87.18 G_A_MAG_CS.P$1 68.44,87.5 71.43,87.5 v72.32,88.38
!GYRO_CS  (via drill 0.2)
  Top 0.203: v61.46,87.5 61.46,88.45 U201.5 | v45.4,70.61 46.52,70.61 U101.7 | v58.26,83.88 v58.26,71.94
  Bottom 0.203: v61.46,87.5 61.46,85.91 60.83,85.91 G_CS.P$1 60.61,85.81 58.67,83.88 v58.26,83.88 | v45.4,70.61 51.73,70.61 53.06,71.94 v58.26,71.94
!IO-LED_SAFETY  (via drill 0.2)
  Top 0.203: v81.14,75.43 80.19,75.43 U301.26
  Bottom 0.203: v81.14,75.43 82.73,73.84 IO-L-SAF.P$1
!MPU_CS  (via drill 0.2)
  Top 0.203: v44.89,87.55 44.99,87.65 44.99,88.36 U203.8 | v45.4,76.02 45.81,75.61 46.52,75.61 U101.17
  Bottom 0.203: v44.89,87.55 44.89,80.41 45.4,79.89 v45.4,76.02
!SPI_EXT_NSS  (via drill 0.2)
  Top 0.203: v45.5,67.14 45.5,68.67 46.52,68.67 U101.3
  Route2 0.203: v57.65,71.12 57.85,70.92 74.89,70.92 75.3,71.32 v82.24,71.32
  Bottom 0.203: v45.5,67.14 45.91,67.14 47.24,68.47 49.99,68.47 51.02,69.49 53.27,69.49 54.9,71.12 v57.65,71.12 | v82.24,71.32 84.08,71.32 84.49,70.92 J103.5
!VDD_5V_HIPOWER_OC  (via drill 0.2)
  Top 0.203: v39.08,45.1 39.08,44.48 U403.4 | v40.2,42.85 40.5,42.85 41.63,43.97 R418.1 41.52,43.97 v41.52,48.77 | v38.36,78.57 37.14,79.79 37.14,81.63 U101.41
  Route15 0.203: v38.36,78.57 38.36,76.83 41.22,73.98 41.22,68.26 43.77,65.71 43.77,63.47 42.44,62.14 42.44,49.69 v41.52,48.77
  Bottom 0.203: v39.08,45.1 39.08,43.97 v40.2,42.85
!VDD_5V_PERIPH_EN  (via drill 0.2)
  Top 0.203: 32.03,53.46 32.03,53.67 32.65,54.28 v32.65,58.36 | 32.03,53.46 32.03,47.55 32.34,47.24 33.36,47.24 36.12,44.48 37.14,44.48 U403.5 | R420.2 41.63,51.73 40.5,51.73 39.69,52.55 37.65,52.55 37.24,52.14 U404.5 37.14,52.14 35.81,53.46 33.56,53.46 32.03,53.46 | U101.67 30.61,71.63 31.52,71.63 31.53,71.62 32.25,71.62 33.52,70.35 33.52,69.33 32.96,68.77 v32.44,68.77
  Route15 0.203: v32.44,68.77 32.44,65.71 33.56,64.59 33.56,62.44 32.65,61.53 v32.65,58.36
!VDD_5V_PERIPH_OC  (via drill 0.2)
  Top 0.203: v39.79,51.63 39.38,52.03 39.08,52.03 U404.4 | v34.69,83.57 34.59,83.47 34.59,81.73 U101.46
  Route15 0.203: v34.69,83.57 34.69,83.26 34.48,83.06 34.48,79.79 35.71,78.57 35.71,60.71 v33.36,58.36
  Bottom 0.203: v39.79,51.63 39.79,51.32 40.66,50.45 | 40.66,50.45 42.14,48.97 42.14,47.65 R421.1 | v33.36,58.36 33.87,58.87 34.28,58.87 37.44,55.71 37.44,50.51 38.05,49.89 40.09,49.89 40.66,50.45
+5V  (via drill 0.7)
  Bottom 0.406: J305.1 16.76,10.91 v16.76,12.69
+5V_V  (via drill 0.3)
  Top 0.305: U304.3 19.68,29.34 C313.P$1
  Top 0.406: v16.25,34.54 18.89,34.54 U302.16 18.91,31.36 v19.55,30.73 C313.P$1
  Bottom 0.305: U303.3 25.52,29.34 C310.P$1 | C311.P$1 18.17,33.76 U302.16
  Bottom 0.406: C311.P$1 v16.25,34.54 | 25.52,29.34 25.65,29.47 25.65,29.96 24.88,30.73 v19.55,30.73
+12V  (via drill 0.7)
  Bottom 0.406: J304.1 12.69,12.69 v10.15,12.69
+12V_CAN  (via drill 0.7)
  Bottom 0.406: J301.1 20.82,10.91 v20.82,12.69
+32V_CAN  (via drill 0.7)
  Bottom 0.406: J302.1 26.66,10.91 v26.66,12.69
+55V1  (via drill 0.3)
  Top 1.016: J401.2 J401.1 74.67,13.71 66.79,13.71 v66.79,17.52 v66.79,16.76 66.79,17.26 D402.A
  Bottom 1.016: v66.79,16.76 v66.79,17.52 66.79,17.26 D402.A
+55V1_V  (via drill 0.3)
  Top 0.305: U401.3 54.75,26.64 54.98,26.41 55.4,26.83 U401.4 | R401.2 54.59,26.02 54.6,26.03
  Top 1.016: 54.98,26.41 54.6,26.03 52.25,23.68 C401.1 52.25,21.33 v54.09,21.33 | v54.09,22.09 v54.09,21.33 | v54.09,21.33 v54.09,20.57 v54.09,18.53 v54.09,17.77 | v54.09,17.77 v54.09,17.01 v59.17,17.01 | C402.1 v54.09,17.77 | v59.17,17.77 v59.17,17.01 | D402.C 59.17,17.26 v59.17,17.01
  Bottom 1.016: v54.09,22.09 v54.09,21.33 | v54.09,21.33 v54.09,20.57 v54.09,18.53 v54.09,17.77 | v54.09,17.77 v54.09,17.01 | v54.09,17.77 C402.1 | C401.1 52.25,21.33 v54.09,21.33 | v59.17,17.77 v59.17,17.01 59.17,17.26 D402.C
+55V2  (via drill 0.3)
  Top 1.016: J402.2 J402.1 v83.81,10.91 | 84.32,10.91 v83.81,10.91 | v83.81,10.91 v84.83,10.91 84.32,10.91 | 84.32,10.91 D403.A
  Bottom 1.016: 84.32,10.91 v83.81,10.91 | v84.83,10.91 84.32,10.91 | D403.A 84.32,10.91
+55V2_V  (via drill 0.3)
  Top 0.305: R409.2 70.85,26.03 76.7,26.03 77.08,25.65 | U402.4 78.26,26.83 77.84,26.41 77.61,26.64 U402.3
  Top 1.016: 77.84,26.41 77.08,25.65 75.11,23.68 C419.1 76.95,21.84 | v76.95,17.77 v76.95,17.01 v81.53,17.01 v81.53,17.77 81.53,17.13 D403.C | v76.95,17.77 v76.95,18.53 v76.95,20.82 v76.95,21.58 | v76.95,21.58 v76.95,22.34 76.95,21.84 | v76.95,17.77 C418.1 | 76.95,21.84 v76.95,21.58
  Bottom 1.016: v76.95,22.34 v76.95,21.58 | v76.95,21.58 v76.95,20.82 v76.95,18.53 v76.95,17.77 | v76.95,17.77 v76.95,17.01 | 75.11,21.58 C419.1 76.95,21.84 v76.95,21.58 | C418.1 v76.95,17.77 | v81.53,17.77 v81.53,17.01 81.53,17.13 D403.C
?!VBUS_VALID  (via drill 0.2)
  Top 0.203: v44.69,74.79 45.61,74.79 45.71,74.69 46.52,74.69 U101.15
  Route2 0.203: v47.85,74.49 47.55,74.79 v44.69,74.79
  Bottom 0.203: v47.85,74.49 48.97,75.61 49.48,75.61 VBUS_V.P$1
?!VDD_BRICK_VALID  (via drill 0.2)
  Top 0.203: v40.09,67.04 40.09,65.71 U101.91
  Bottom 0.203: v40.09,67.04 38.67,65.61 38.67,64.38 37.14,62.85 37.14,61.02 VDD_BV.P$1
?!VDD_SERVO_VALID  (via drill 0.2)
  Top 0.203: v40.82,64.32 41.14,64.64 41.14,65.59 U101.93
  Bottom 0.203: v40.82,64.32 40.51,64.32 39.87,63.68 VDD_SV.P$1
?FMU-SWCLK  (via drill 0.2)
  Top 0.203: v32.34,62.34 32.34,65.4 32.54,65.61 U101.76
  Bottom 0.203: v32.34,62.34 32.03,62.04 32.03,61.53 F-SLK.P$1
?FMU-SWDIO  (via drill 0.2)
  Top 0.203: v27.64,69.89 28.56,69.89 29.28,69.18 30.5,69.18 U101.72
  Bottom 0.203: v27.64,69.89 26.93,70.61 26.93,71.02 F-SIO.P$1
?FMU-SWO  (via drill 0.2)
  Top 0.203: v39.08,67.04 39.08,65.71 U101.89
  Bottom 0.203: v39.08,67.04 38.36,67.04 35.09,63.77 35.09,63.57 F-SWD.P$1
?PRESSURE_SENS  (via drill 0.2)
  Top 0.203: v40.81,83.36 40.81,82.75 40.61,82.55 40.61,81.73 U101.34
  Bottom 0.203: v40.81,83.36 40.81,84.28 P_SENS.P$1
ACCEL_DRDY  (via drill 0.2)
  Top 0.203: v74.08,88.36 74.08,89.18 U202.6 | v46.01,64.79 44.08,62.85 41.52,62.85 39.59,64.79 39.59,65.61 U101.90
  Bottom 0.203: 66.86,84.32 A_DRDY.P$1 | v74.08,88.36 73.47,88.36 69.49,84.39 66.94,84.39 A_DRDY.P$1 | v46.01,64.79 44.08,66.73 44.08,69.79 43.77,70.1 43.77,71.94 47.24,75.41 47.24,75.92 47.85,76.53 53.67,76.53 55.51,74.69 59.28,74.69 60.3,75.71 60.3,77.85 66.73,84.28 A_DRDY.P$1
ALARM  (via drill 0.2)
  Top 0.203: v31.01,61.53 31.01,62.04 30.91,62.14 30.91,65.3 32.34,66.73 32.95,66.73 33.05,66.63 33.05,65.71 U101.77
  Bottom 0.203: v31.01,61.53 30.81,61.73 29.48,61.73 R110.1
AUX_OUT1  (via drill 0.2)
  Top 0.203: v19.79,51.12 19.79,45.4 v24.07,41.12
  Bottom 0.203: v19.79,51.12 19.48,51.42 19.48,52.85 21.73,55.1 21.73,62.85 22.14,63.26 22.64,63.26 23.77,62.14 R430.2 | v24.07,41.12 28.16,41.12 30.71,38.56 30.71,13.77 29.99,13.05 29.99,10.2 30.2,9.99 52.34,9.99 53.77,11.42 55.2,11.42 56.83,9.79 65.2,9.79 66.53,8.46 J403.2
AUX_OUT2  (via drill 0.2)
  Top 0.203: v39.18,1.73 v39.18,17.64 | v65.3,4.68 v65.3,2.34 | v20.91,52.85 v20.91,59.18
  Route2 0.203: v20.91,52.85 21.22,52.55 v28.56,52.55
  Bottom 0.203: v28.56,52.55 28.87,52.55 29.69,51.73 30.2,51.73 33.16,48.77 33.16,44.38 38.67,38.87 38.67,24.28 38.36,23.97 38.36,18.46 v39.18,17.64 | v39.18,1.73 64.69,1.73 v65.3,2.34 | v65.3,4.68 66.53,5.91 J403.3 | R426.2 20.91,62.04 v20.91,60.71 v20.91,59.18
AUX_OUT3  (via drill 0.2)
  Top 0.203: v30.09,1.11 51.32,1.11 57.65,7.44 62.55,7.44 63.47,8.36 J404.2
  Bottom 0.203: v30.09,1.11 3.96,1.11 1.01,4.07 1.01,46.93 3.46,49.38 14.38,49.38 14.69,49.08 16.93,49.08 17.75,49.89 17.75,62.04 R431.2
AUX_OUT4  (via drill 0.2)
  Top 0.203: v30.09,25.2 29.99,25.09 29.99,9.48 v30.09,9.38 | v36.12,2.34 v36.12,7.64 | v62.44,5.19 v62.44,2.34 | v14.38,60.61 14.38,58.67 15.4,57.65 15.4,53.67 14.99,53.26 14.99,48.16 v14.89,48.05 | v31.22,45.4 32.24,45.4 v32.34,45.3
  Route2 0.203: v29.79,35.4 v32.95,35.4
  Bottom 0.203: v32.34,45.3 32.34,39.48 32.95,38.87 v32.95,35.4 | v29.79,35.4 29.79,33.36 30.2,32.95 30.2,25.3 v30.09,25.2 | v30.09,9.38 34.38,9.38 v36.12,7.64 | v62.44,2.34 v36.12,2.34 | v62.44,5.19 62.85,5.19 63.47,5.81 J404.3 | v14.38,60.61 14.69,60.91 14.69,61.53 R427.2 | v14.89,48.05 18.16,48.05 20.81,45.4 20.81,42.44 21.42,41.83 27.85,41.83 31.22,45.2 v31.22,45.4
AUX_OUT5  (via drill 0.2, 0.3)
  Top 0.203: v18.97,61.22 19.28,61.53 19.28,63.57 R432.2 | v15.99,41.65 16.5,41.14 v19.04,41.14
  Route15 0.203: v18.97,61.22 18.97,45.3 15.99,42.32 v15.99,41.65 | J405.2 69.59,8.46 68.26,9.79 48.05,9.79 46.63,11.21 46.63,12.64 39.08,20.2 39.08,27.85 28.36,38.56 28.35,38.56 26.59,40.33 19.86,40.33 v19.04,41.14
AUX_OUT6  (via drill 0.2)
  Top 0.203: v22.34,62.65 22.34,63.57 R428.2
  Route2 0.203: J405.3 69.59,5.91 68.67,6.83 66.73,6.83 63.77,9.79 51.12,9.79 42.65,18.26 38.87,18.26 37.03,20.09 37.03,23.97 38.26,25.2 38.26,36.73 23.97,51.02 21.01,51.02 v20.09,51.93
  Bottom 0.203: v22.34,62.65 22.34,55.1 20.09,52.85 v20.09,51.93
BATT_CURRENT_SENS  (via drill 0.2)
  Top 0.203: v46.85,83.05 44.63,83.05 44.63,81.78 U101.26
  Bottom 0.203: v46.85,83.05 47.81,83.05 R422.2
BATT_VOLTAGE_SENS  (via drill 0.2)
  Top 0.203: v47.85,79.79 46.73,79.79 46.63,79.69 U101.25
  Bottom 0.203: v47.85,79.79 47.85,80.71 R423.2
CAN1_RX  (via drill 0.2)
  Top 0.203: v32.95,64.38 34.69,64.38 35.09,64.79 35.09,65.61 U101.81
  Route15 0.203: v32.95,64.38 32.44,64.38 25.91,57.85 v25.91,56.63
  Bottom 0.203: v25.91,56.63 25.91,55.1 23.97,53.16 23.97,43.77 U302.5
CAN1_TX  (via drill 0.2)
  Top 0.203: v31.52,62.34 32.14,61.73 32.65,61.73 35.6,64.69 35.6,65.61 U101.82
  Route15 0.203: v31.52,62.34 31.01,62.34 27.85,59.18 27.85,57.75 23.77,53.67 v23.66,53.67
  Bottom 0.203: v23.66,53.67 23.66,53.46 21.52,51.32 21.52,43.77 U302.3
CAN2_RX  (via drill 0.2)
  Top 0.203: v28.26,81.02 29.58,79.69 30.5,79.69 U101.51
  Route15 0.203: v28.26,81.02 28.26,79.08 27.64,78.47 27.64,77.85 28.77,76.73 28.77,73.36 29.58,72.55 29.58,62.14 23.05,55.61 23.05,53.46 23.46,53.06 24.69,53.06 v24.79,53.16
  Bottom 0.203: v24.79,53.16 24.79,44.18 25.2,43.77 U302.6
CAN2_RX_IN
  Bottom 0.305: U302.11 25.27,31.55 26.79,30.03 U303.4
CAN2_TX  (via drill 0.2)
  Top 0.203: v40.81,66.94 40.61,66.73 40.61,65.71 U101.92 | v37.14,59.18 32.65,59.18 30.81,57.34 30.81,53.16 v28.36,50.71
  Bottom 0.203: v40.81,66.94 40.81,65.91 37.95,63.06 37.95,59.99 v37.14,59.18 | v28.36,50.71 25.91,48.26 25.91,42.44 25.71,42.24 23.56,42.24 22.75,43.05 22.75,43.67 U302.4
CAN2_TX_IN  (via drill 0.3)
  Top 0.305: v23.36,27.17 23.11,27.42 v23.11,32.5
  Bottom 0.305: U303.1 22.98,26.79 v23.36,27.17 | U302.13 22.73,32.88 v23.11,32.5
D1_O
  Top 0.203: 56.06,35.99 56.06,36.06 56.13,35.93
  Top 0.305: U401.16 56.06,35.99 | U401.15 56.7,35.99 | 57.4,40.34 D405.1
  pour Top: 56.13,35.93 56.76,35.93 56.76,36.57 59.68,39.49 59.68,46.47 59.3,46.85 56.51,46.85 56.13,46.47
D1X  (via drill 0.3)
  Top 0.305: D405.3 49.78,42.91 | U401.19 54.1,35.99 54.35,35.99 | U401.18 54.76,35.99 54.86,35.99 | U401.17 55.4,35.99 55.3,35.99
  Top 0.406: C409.P$1 54.35,35.99 54.86,35.99 55.3,35.99 55.36,36.06 | 52.49,50.03 L401.P$1
  other vias: 48.76,43.17 50.28,43.17 51.81,43.17 45.71,43.17 47.24,43.17 53.33,43.17 53.33,45.2 53.33,47.24 51.81,47.24 50.28,47.24 48.76,47.24 47.24,47.24 51.81,45.2 50.28,45.2 48.76,45.2 47.24,45.2 45.71,45.2 53.33,41.14 51.81,41.14 50.28,41.14 48.76,41.14 47.24,41.14 45.71,41.14 50.28,39.11 48.76,39.11 47.24,39.11
  pour Bottom: 54.35,38.6 46.73,38.6 45.2,40.12 45.2,46.22 47.24,48.25 53.33,48.25 54.35,47.24
  pour Top: 53.84,36.06 53.84,37.08 52.32,38.6 46.73,38.6 45.2,40.12 45.2,50.28 47.74,52.82 59.94,52.82 61.97,50.79 61.97,48.76 61.46,48.25 55.36,48.25 54.35,47.24 54.35,38.6 55.36,37.58 55.36,36.06
D2_O
  Top 0.305: U402.15 79.56,35.99 79.49,36.06 | U402.16 78.92,35.99 78.99,36.06
  pour Top: 78.99,36.06 79.62,36.06 79.62,36.7 82.54,39.62 82.54,46.6 82.16,46.98 79.37,46.98 78.99,46.6
D2X  (via drill 0.3)
  Top 0.305: C426.P$1 73.65,36.06 76.96,36.06 | 76.96,36.06 77.62,36.06 | 77.62,36.06 78.26,36.06 U402.17 | U402.18 77.62,36.06 | U402.19 76.96,36.06
  other vias: 71.62,43.17 70.1,43.17 68.57,43.17 76.19,43.17 76.19,45.2 76.19,47.24 74.67,47.24 73.14,47.24 71.62,47.24 70.1,47.24 70.1,45.2 71.62,45.2 73.14,45.2 74.67,45.2 76.19,41.14 74.67,41.14 73.14,41.14 71.62,41.14 70.1,41.14 68.57,41.14 70.1,39.11 71.62,39.11 73.14,39.11 74.67,39.11 68.57,45.2 74.67,43.17 73.14,43.17
  pour Bottom: 77.21,38.6 69.59,38.6 68.06,40.12 68.06,46.22 70.1,48.25 76.19,48.25 77.21,47.24
  pour Top: 76.7,36.06 76.7,37.08 75.18,38.6 69.59,38.6 68.06,40.12 68.06,50.28 70.6,52.82 82.8,52.82 84.83,50.79 84.83,48.76 84.32,48.25 78.22,48.25 77.21,47.24 77.21,38.6 78.22,37.58 78.22,36.06
FMU-!RESET  (via drill 0.2)
  Top 0.203: v45.2,74.18 46.52,74.18 U101.14
  Bottom 0.203: C110.P$1 3.36,63.05 3.36,65.59 S101.A1 3.36,65.81 9.58,72.04 25.9,72.04 25.9,69.28 28.2,69.28 31.03,72.11 32.27,72.11 34.03,70.35 34.03,68.44 33.52,67.94 33.52,67.28 33.87,66.94 36.22,66.94 38.77,69.49 41.12,69.49 42.14,70.51 42.14,71.32 44.99,74.18 v45.2,74.18
FMU-BOOT0  (via drill 0.2)
  Top 0.203: v41.52,64.08 41.63,64.18 41.63,65.61 U101.94
  Bottom 0.203: v41.52,64.08 40.71,63.26 40.71,61.32 R109.2
FMU-CH1  (via drill 0.2)
  Top 0.203: v14.18,79.28 11.73,76.83 11.73,76.12 U408.7 | v35.09,80 35.09,81.63 U101.45
  Bottom 0.203: v14.18,79.28 14.39,79.08 33.56,79.08 34.07,78.57 34.48,78.57 35.09,79.18 v35.09,80
FMU-CH2  (via drill 0.2)
  Top 0.203: v26.52,83.16 18.87,83.16 12.44,76.73 12.44,76.12 U408.6 | v35.2,82.96 35.6,82.55 35.6,81.73 U101.44
  Bottom 0.203: v26.52,83.16 26.93,83.16 27.24,83.47 29.69,83.47 30.2,82.96 v35.2,82.96
FMU-CH3  (via drill 0.2)
  Top 0.203: v29.79,81.12 29.28,81.63 17.95,81.63 13.05,76.73 13.05,76.12 U408.5 | v33.77,80.3 33.97,80.3 34.89,79.39 35.5,79.39 36.63,80.51 36.63,81.63 U101.42
  Bottom 0.203: v29.79,81.12 32.95,81.12 v33.77,80.3
FMU-CH4  (via drill 0.2)
  Top 0.203: U408.4 13.71,76.08 13.71,76.7 18.03,81.02 v27.17,81.02 | v37.33,83.43 37.6,83.16 U101.40
  Route2 0.203: v37.33,83.43 37.58,83.18 37.58,82.16 27.17,82.16 v27.17,81.02
FMU-CH5  (via drill 0.2)
  Top 0.203: U408.3 14.34,76.07 14.34,76.7 14.72,77.08 v17.39,77.08 | U101.60 31.59,75.15 v31.89,75.48
  Route2 0.203: v17.39,77.08 17.64,77.33 25.14,77.33 v25.77,76.7
  Bottom 0.203: v31.89,75.48 32.5,76.06 32.5,76.95 28.31,76.95 28.06,76.7 v25.77,76.7
FMU-CH6  (via drill 0.2)
  Top 0.203: v17.34,76.02 15.71,76.02 U408.1 | v32.46,74.69 30.61,74.69 U101.61
  Bottom 0.203: v17.34,76.02 23.26,76.02 23.97,75.3 29.95,75.3 U101.61 32.43,74.65 v32.46,74.69 31.01,74.69
FMU-I2C1_SCL  (via drill 0.3)
  Top 0.203: U101.95 42.1,63.44 v41.95,63.44 | v39.97,20.92 41.08,20.92 R316.1
  Top 0.305: R316.1 41.14,19.5 42.66,17.98 R318.1
  Route15 0.203: v41.95,63.44 41.95,54.6 40.89,53.53 40.89,37.08 39.21,35.4 39.21,29.3 41.04,29.3 41.04,21.99 v39.97,20.92
FMU-I2C1_SDA  (via drill 0.3)
  Top 0.203: R317.1 37.93,20.99 v37.69,21.23 | v42.92,63.49 42.6,63.81 U101.96
  Top 0.305: 42.66,7.1 41.65,8.12 41.65,17.63 40.06,17.63 38.7,18.99 38.7,20.88 R317.1
  Top 0.406: R319.1 42.66,7.1
  Route2 0.203: v37.69,21.23 37.69,23.97 38.91,25.19 38.91,35.4 40.73,37.23 v40.73,54.7 41.9,55.87 41.9,61.97 42.92,62.98 v42.92,63.49
FMU-UART4_RX  (via drill 0.2)
  Top 0.203: v14.58,79.89 13.97,79.89 11.11,77.04 11.11,76.12 U408.8 | v34.28,79.18 34.48,79.18 35.71,77.96 42.14,77.96 42.85,78.67 45.2,78.67 45.71,79.18 46.52,79.18 U101.24
  Bottom 0.203: v14.58,79.89 14.94,79.89 15.35,79.49 33.97,79.49 v34.28,79.18
FMU-UART4_TX  (via drill 0.2)
  Top 0.203: 10.34,76.06 U408.9 10.5,76.12 10.5,77.04 16.06,82.6 v16.73,82.6 | v48.26,84.89 48.26,80.2 48.46,80 48.46,79.59 47.55,78.67 46.63,78.67 U101.23
  Route2 0.203: v16.73,82.6 22.03,82.6 25.55,86.12 47.03,86.12 v48.26,84.89
FMU-UART7_RX  (via drill 0.2)
  Top 0.203: v37.85,80.41 38.26,80.41 38.56,80.71 38.56,81.63 U101.38 | v14.79,56.22 14.79,53.67 7.24,46.12 7.24,43.77 U305.6
  Route2 0.203: v37.85,80.41 34.89,77.45 30.2,77.45 26.32,73.57 26.32,72.96 24.28,70.92 24.28,65.71 v14.79,56.22
FMU-UART7_TX  (via drill 0.2)
  Top 0.203: v34.69,84.28 36.57,84.28 36.57,84.07 38.05,84.07 38.05,83.69 38.05,81.73 U101.39 | v21.73,84.89 21.52,85.1 17.03,85.1 14.38,87.75 10.2,87.75 9.28,86.83 9.28,76.83 7.95,75.51 7.95,70 10.3,67.65 10.3,61.02 5.3,56.02 5.3,49.48 6.62,48.16 6.62,42.44 6.83,42.24 8.87,42.24 9.68,43.05 9.68,43.67 U305.4
  Bottom 0.203: v34.69,84.28 32.43,84.28 31.82,84.89 v21.73,84.89
FMU-UART8_RX  (via drill 0.2)
  Top 0.203: v41.73,66.94 42.65,66.94 43.05,66.53 43.05,65.71 U101.97 | v14.38,48.57 12.75,48.57 8.56,44.38 8.56,43.77 U305.5
  Route2 0.203: v41.73,66.94 33.77,58.98 32.14,58.98 27.44,54.28 20.09,54.28 v14.38,48.57
FMU-UART8_TX  (via drill 0.2)
  Top 0.203: v43.16,64.28 43.56,64.69 43.56,65.61 U101.98 | v13.05,39.08 13.05,39.79 11.11,41.73 11.11,43.67 U305.3
  Route15 0.203: v43.16,64.28 42.14,64.28 41.52,64.89 40.61,64.89 34.69,58.98 34.69,57.65 28.97,51.93 27.64,51.93 14.79,39.08 v13.05,39.08
FMU-USART2_CTS  (via drill 0.2)
  Top 0.203: v29.07,57.65 28.05,58.67 26.32,58.67 26.01,58.36 26.01,57.85 U306.3 | v34.18,62.34 36.63,64.79 36.63,65.61 U101.84
  Bottom 0.203: v29.07,57.65 29.48,57.65 v34.18,62.34
FMU-USART2_RTS  (via drill 0.2)
  Top 0.203: v27.75,56.73 27.34,57.14 27.34,57.75 U306.1 | v31.32,60.71 33.46,60.71 37.14,64.38 37.14,65.61 U101.85
  Bottom 0.203: v27.75,56.73 27.75,57.14 29.79,59.18 30.09,59.18 31.32,60.4 v31.32,60.71
FMU-USART2_RX  (via drill 0.2)
  Top 0.203: v23.97,58.87 23.97,57.85 U306.6 | U101.87 38.05,65.61 38.05,62.05 36.72,60.71 v34.38,60.71
  Route2 0.203: v23.97,58.87 24.18,58.87 24.79,58.26 30.81,58.26 32.95,60.4 34.07,60.4 v34.38,60.71
FMU-USART2_TX  (via drill 0.2)
  Top 0.203: v23.23,59.05 23.4,58.88 U306.7 | v36.44,62.6 37.6,63.76 U101.86
  Route2 0.203: v26.79,61.08 29.07,63.37 36.19,63.37 36.44,63.11 v36.44,62.6
  Route15 0.203: v23.23,59.05 23.23,60.83 23.49,61.08 v26.79,61.08
FMU-USART3_CTS  (via drill 0.2)
  Top 0.203: v31.83,76.22 31.52,76.22 31.42,76.12 30.61,76.12 U101.58
  Route15 0.203: v28.26,78.26 28.97,78.26 31.01,76.22 v31.83,76.22
  Bottom 0.203: v28.26,78.26 26.93,78.26 F-CTS.P$1
FMU-USART3_RTS  (via drill 0.2)
  Top 0.203: v29.38,74.64 29.38,75.3 29.69,75.61 30.5,75.61 U101.59
  Bottom 0.203: F-RTS.P$1 26.93,74.18 28.92,74.18 v29.38,74.64
FMU-USART3_RX  (via drill 0.2)
  Top 0.203: v25.4,58.87 25.4,57.85 U306.4 | v26.22,75.92 28.36,75.92 29.58,77.14 30.5,77.14 U101.56
  Route2 0.203: v23.66,65.91 23.66,67.04 23.77,67.14 23.77,69.89 22.44,71.22 22.44,72.14 v26.22,75.92
  Bottom 0.203: v25.4,58.87 25.4,64.18 v23.66,65.91
FMU-USART3_TX  (via drill 0.2)
  Top 0.203: v24.69,59.18 24.69,57.85 U306.5 | U101.55 31.52,77.65 32.4,76.78 v33.23,76.78
  Route2 0.203: v24.69,59.18 24.69,60.51 25.3,61.12 25.3,66.83 26.11,67.65 26.11,70.92 28.87,73.67 32.78,73.67 33.22,74.11 33.22,76.77 v33.23,76.78
FMU-VDD_3V3  (via drill 0.3)
  Top 0.152: U204.1 29.95,91.92 | U204.8 31.4,88.8
  Top 0.203: U101.75 29.55,67.65 28.44,66.54 C105.P$1 | U101.21 U101.22 48,78.15 | 43.6,85.68 C103.P$1 | 29.95,91.92 29.71,91.69 29.71,89.4 30.47,88.64 31.23,88.64 | 31.4,88.8 31.23,88.64 | R107.2 31.15,88.55 31.23,88.64 | v43.43,84.83 43.6,84.83 U101.28 | 48,78.15 48,76.65 U101.19 44.7,76.65 43.89,75.84 43.89,72.64 46.6,72.64 U101.11 | U101.100 44.6,65.78 46.74,65.78 C106.P$1 | 48,78.15 50.99,78.15 C109.P$1
  Top 0.254: U101.50 31.35,81.65 C104.P$1
  Top 0.305: U305.1 14.99,43.71 C319.P$1 v16.25,43.43 | U408.10 9.77,74.16 14.97,74.16 | 14.98,73.65 14.98,74.16 14.97,74.16 | 14.98,73.65 U408.19 | U408.2 14.97,74.16 | C434.P$1 18.03,73.65 | 18.03,73.65 14.98,73.65 | U306.10 21.45,55.87 26.65,55.87 | U306.2 26.66,57.76 26.66,55.87 26.65,55.87 | U306.19 26.65,55.61 | 26.65,55.61 26.65,55.87 | C328.P$1 26.65,55.61 | 18.03,73.65 v18.03,74.41 18.52,74.91 C111.P$1 | R317.2 38.6,23.87 38.35,24.12 38.35,35.3 41.65,38.6 v41.65,41.14 42.66,41.14 42.66,61.97
  Top 0.406: C111.P$1 20.95,78.22 U102.8 U102.7 22.22,76.19 23.49,76.19 U102.3 | R116.2 v9.9,84.07 v9.9,86.61 R118.2 R119.2 | C104.P$1 30.21,83.81 v30.22,83.81 31.15,83.81 R107.2 | R418.2 v41.65,41.14 | v43.43,84.83 43.43,85.84 C103.P$1 | v16.25,43.43 19.04,46.22 19.04,59.94 | 17.77,59.94 17.77,69.59 19.55,69.59 19.55,74.41 v18.03,74.41 | C328.P$1 29.96,59.94 | R317.2 R316.2 | R108.2 36.91,84.99 v36.91,84.84 | v43.93,61.97 44.06,62.09 44.57,62.09 46.09,63.62 50.03,63.62 51.17,64.76 v51.17,66.06 51.16,66.04 47.95,66.04 47.5,65.59 C106.P$1 | C105.P$1 26.65,62.61 23.98,59.94 | 50.99,78.15 50.99,79.28 v51.1,79.39
  Top 0.61: v43.93,61.97 42.66,61.97 39.56,61.97 37.53,59.94 29.96,59.94 23.98,59.94 19.04,59.94 17.77,59.94
  Route2 0.305: 43.43,84.73 v43.43,84.83
  Route2 0.406: 43.69,78.23 43.69,84.57 v43.43,84.83 36.91,84.83 v36.91,84.84 36.6,85.14 31.55,85.14 v30.22,83.81 | 43.69,78.23 43.69,77.22 42.27,75.79 42.27,70.1 43.89,70.1 45.92,68.07 49.16,68.07 v51.17,66.06 | 43.69,78.23 45.52,78.23 45.92,78.64 50.34,78.64 v51.1,79.39
  Bottom 0.203: v41.65,41.14 42.09,41.14 42.09,45.59 R421.2
  Bottom 0.305: U302.1 16.99,43.71 C309.P$1 v16.25,43.43 | R116.2 11.33,82.3 | 11.33,82.3 R115.2 11.33,79.6 12.95,77.98 14.46,77.98 v18.03,74.41 | U103.4 20.57,92.21 20.57,87.11 19.04,85.59 17.77,85.59 14.48,82.3 11.33,82.3
  Bottom 0.406: D101.A 55.87,60.95 | R117.2 R116.2 v9.9,84.07 | v9.9,86.61 R118.2 | 43.75,61.97 v43.93,61.97
  Bottom 0.61: 55.87,60.95 U405.4 U405.2 43.75,60.95 | 43.75,60.95 C415.P$1 | v43.17,61.97 v43.93,61.97 | 43.75,60.95 43.75,61.97
FMU_AUX_ADC1  (via drill 0.2)
  Top 0.203: v40.71,34.07 40.71,32.85 R315.1 | v47.85,75.71 47.75,75.81 47.75,75.92 47.55,76.12 46.63,76.12 U101.18
  Route15 0.203: v40.71,34.07 40.71,34.69 43.87,37.85 43.87,55.2 44.79,56.12 v44.79,66.94
  Bottom 0.203: v44.79,66.94 44.79,69.69 44.28,70.2 44.28,71.83 47.85,75.41 v47.85,75.71
FMU_AUX_ADC2  (via drill 0.2)
  Top 0.203: 41.14,81.46 U101.33 41.12,81.43 41.12,80.71 41.93,79.89 v41.93,78.67 | v55.1,75.92 57.14,73.87 57.14,71.42 57.04,71.32 57.04,70.92 57.14,70.81 57.14,67.95 56.93,67.75 55.1,67.75 50.02,62.68 46.63,62.68 45.2,61.26 45.2,57.8 43.31,55.91 43.26,55.91 43.26,41.01 42.34,40.09 42.34,32.03 43.16,31.22 R314.1
  Bottom 0.203: v55.1,75.92 54.89,75.92 53.87,76.94 47.14,76.94 45.61,75.41 45.2,75.41 v41.93,78.67
FRAM_MISO  (via drill 0.2)
  Top 0.203: v25.91,77.96 27.14,76.73 27.54,76.73 29.48,78.67 30.5,78.67 U101.53 | v21.52,76.63 21.52,74.69 22.14,74.08 22.14,73.36 U102.2
  Bottom 0.203: v25.91,77.96 22.85,77.96 v21.52,76.63
FRAM_MOSI  (via drill 0.2)
  Top 0.203: v31.11,80.51 31.73,79.89 31.73,78.36 31.52,78.16 U101.54 | U102.5 24.79,78.57 24.79,79.08 25.3,79.59 v25.3,80.1
  Bottom 0.203: v25.3,80.1 25.6,80.41 31.01,80.41 v31.11,80.51
FRAM_SCK  (via drill 0.2)
  Top 0.203: v27.34,77.34 27.34,79.28 29.58,79.28 29.69,79.18 30.5,79.18 U101.52 | v24.18,75.92 24.07,76.02 24.07,77.96 23.56,78.47 U102.6
  Bottom 0.203: v27.34,77.34 25.6,77.34 v24.18,75.92
GND  (via drill 0.2, 0.3)
  Top 0.152: U204.21 32.2,93.21 | 34.03,91.92 U204.18
  Top 0.203: U101.74 33.1,68.15 v36.57,71.62 | v25.14,67.56 25.14,68.56 C108.P$2 | R306.1 83.18,79.97 U301.35 77.93,79.97 v76.7,78.73 | U101.27 44.1,84.16 44.95,85.01 C103.P$2 | U403.P$3 38.09,43.93 U403.6 34.03,43.93 C432.P$2 | U403.2 38.09,43.43 U403.P$2 | U404.P$2 38.09,51.05 U404.2 40.38,51.05 40.38,49.94 R420.1 41.65,49.78 | U404.P$3 38.09,51.55 U404.6 34.03,51.55 C433.P$2 | v74.67,78.73 74.67,79.62 73.43,80.86 U301.47 73.43,86.35 R307.1 | U301.23 77.93,75.47 v76.7,76.7 | U301.8 74.4,76.97 v74.67,76.7 | 32.2,93.21 34.03,93.21 34.03,91.92 35.17,91.92 35.17,92.19 36.06,92.19 C214.P$2 | U203.18 49.78,91.67 C210.P$2 | U201.8 64.38,88.52 U201.9 U201.10 U201.11 U201.12 64.38,92.32 U201.13 66.27,92.32 C203.P$2 | C207.P$2 74.67,94.48 U202.15 74.67,90.92 U202.12 | U202.13 U202.12 | U202.12 U202.11 U202.10 U202.9 75.89,89.91 v76.95,89.91 | U202.12 v76.95,90.92 | U203.1 U203.18 | C211.P$2 47.99,91.67 U203.18 | R416.1 84,64.64 84,67.49 R408.1 | R102.2 40.82,85.91 38.6,88.13 38.6,88.38 C212.P$2 39.49,88.38 39.49,92.19 38.09,92.19 C213.P$2 | R202.1 58.92,84.64 55.74,84.64 55.74,84.32 v55.62,84.32 | 37.97,43.68 U403.GND | 37.97,51.3 U404.GND | 27.18,82.8 27.17,82.73 v27.42,82.8 | U101.10 44.08,72.15 | 44.08,72.15 41.16,72.15 v40.63,71.62 | 18.39,86.98 17.38,86.98 v17.26,86.86 | v66.73,74.08 66.73,73.16 C301.P$2 | 44.08,72.15 44.08,65.71 U101.99 | U101.20 42.1,77.15 v40.63,75.68
  Top 0.254: C105.P$2 C108.P$2 25.14,68.57 v25.14,70.35 | C209.P$2 52.32,92.19 | 52.32,92.19 v51.81,92.19 | 52.32,92.19 v52.57,92.19 | v37.58,93.21 v38.35,93.21 38.09,93.21 C213.P$2 | v54.86,93.46 v55.62,93.46 | C201.P$2 55.36,93.46 v55.62,93.46 | v55.62,93.46 55.62,94.48 R203.1 | 57.9,93.46 v55.62,93.46 | C206.P$2 C205.P$2 68.57,89.15 v68.83,89.15 v68.06,89.15 | C202.P$2 57.9,93.46 | 57.9,93.46 63.45,93.46 U201.13 | C208.P$2 48.51,85.86 v48.51,87.72 | U105.2 v5.58,77.72 | v46.73,84.57 45.71,84.57 45.71,85.59 44.94,85.59 C103.P$2
  Top 0.305: U401.14 57.36,31.52 57.4,31.49 57.52,31.61 | U401.13 58.01,32.1 57.52,31.61 | U401.10 59.31,30.59 59.17,30.73 58.41,30.73 57.52,31.61 | U402.10 82.17,31.1 v81.78,31.49 | U402.14 80.22,31.52 80.26,31.49 | U402.13 80.87,31.59 v80.76,31.49 | C303.P$1 64.67,75.28 X301.4 63.82,78.49 C302.P$2 | C102.P$1 53.67,76.09 X101.4 54.02,73.39 C101.P$2 | U305.8 4.69,47.38 C318.P$2 | C319.P$2 12.93,46.46 12.31,45.84 U305.2 | C209.P$2 C210.P$2 | C215.P$2 18.39,86.98 U205.2 | C104.P$2 v27.42,82.8 27.18,82.8 | 27.17,82.8 27.18,82.8 | 27.18,82.8 C107.P$2 | GND.P$1 v13.71,91.43 | C111.P$2 v16.17,78.22 | C214.P$2 C213.P$2 | L102.P$5 82.4,66.03 R416.1 | v31.75,56.64 31.75,54.36 31.5,54.1 31.5,52.07 v31.24,51.82 | U306.11 21.45,50.91 v20.57,50.03